# EasyEDA Pro project PCB_2025-11-01.epro

# Board FINAL
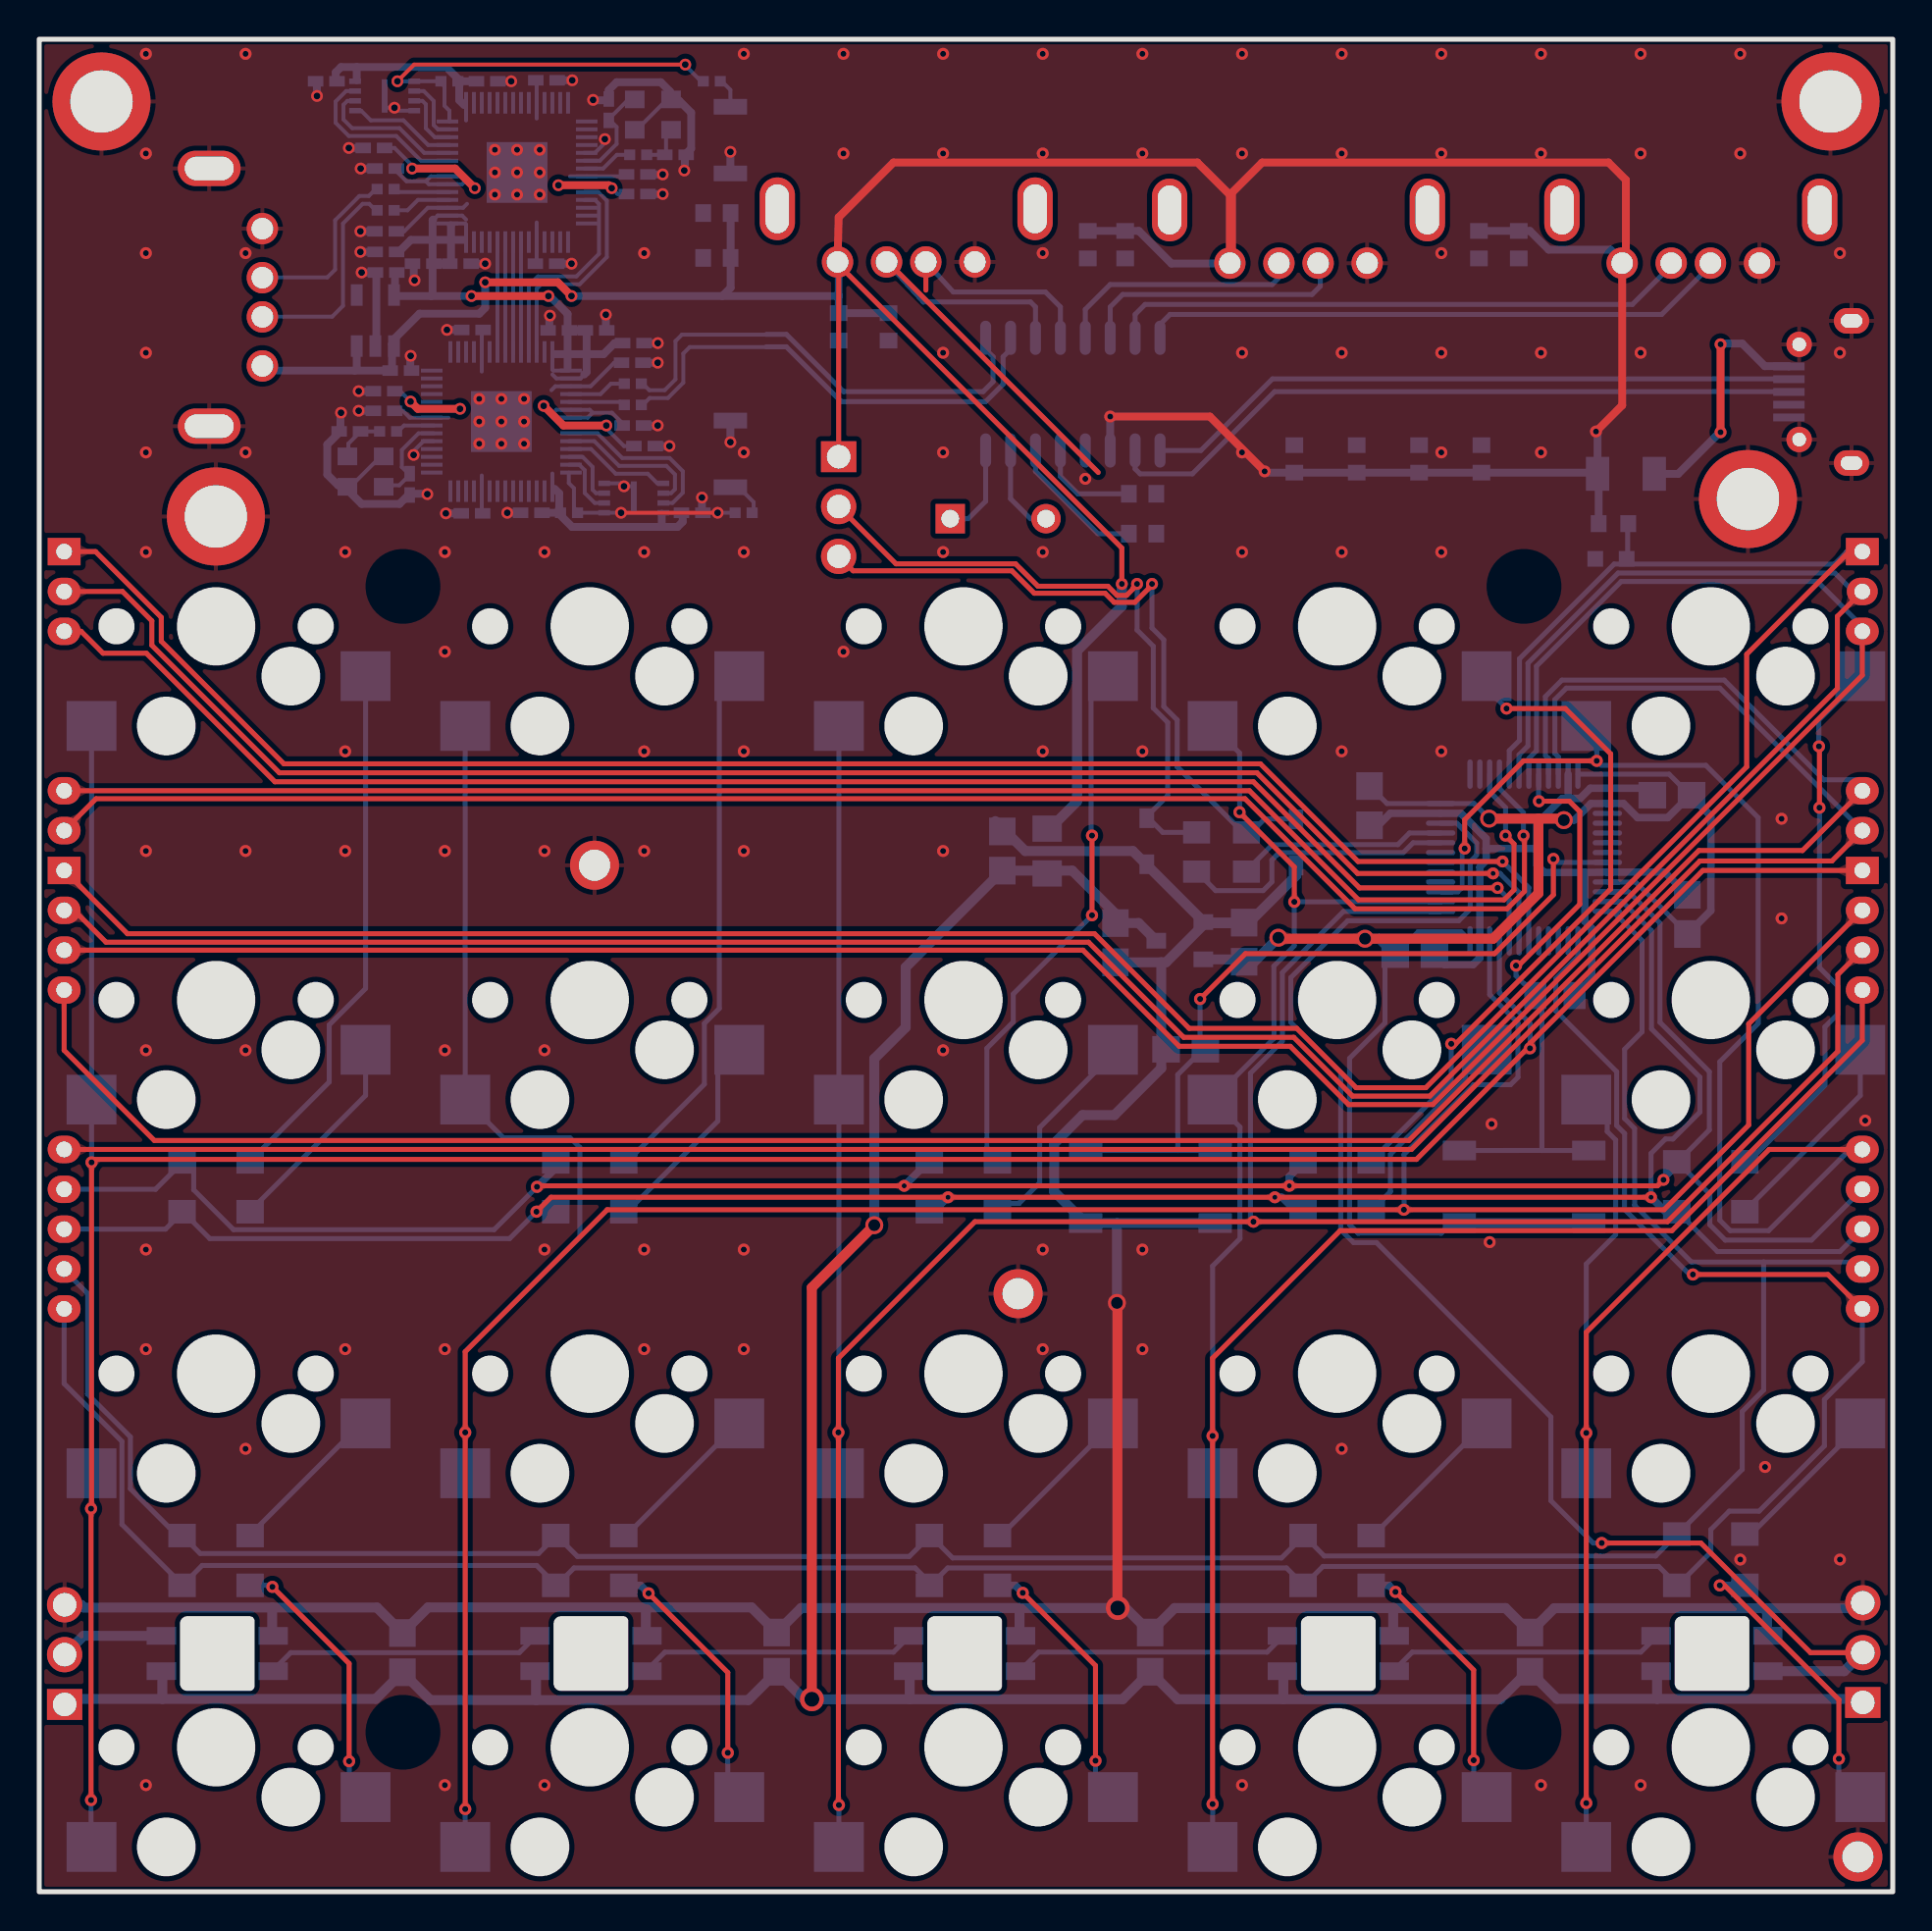
[diagram p0: board, top side]
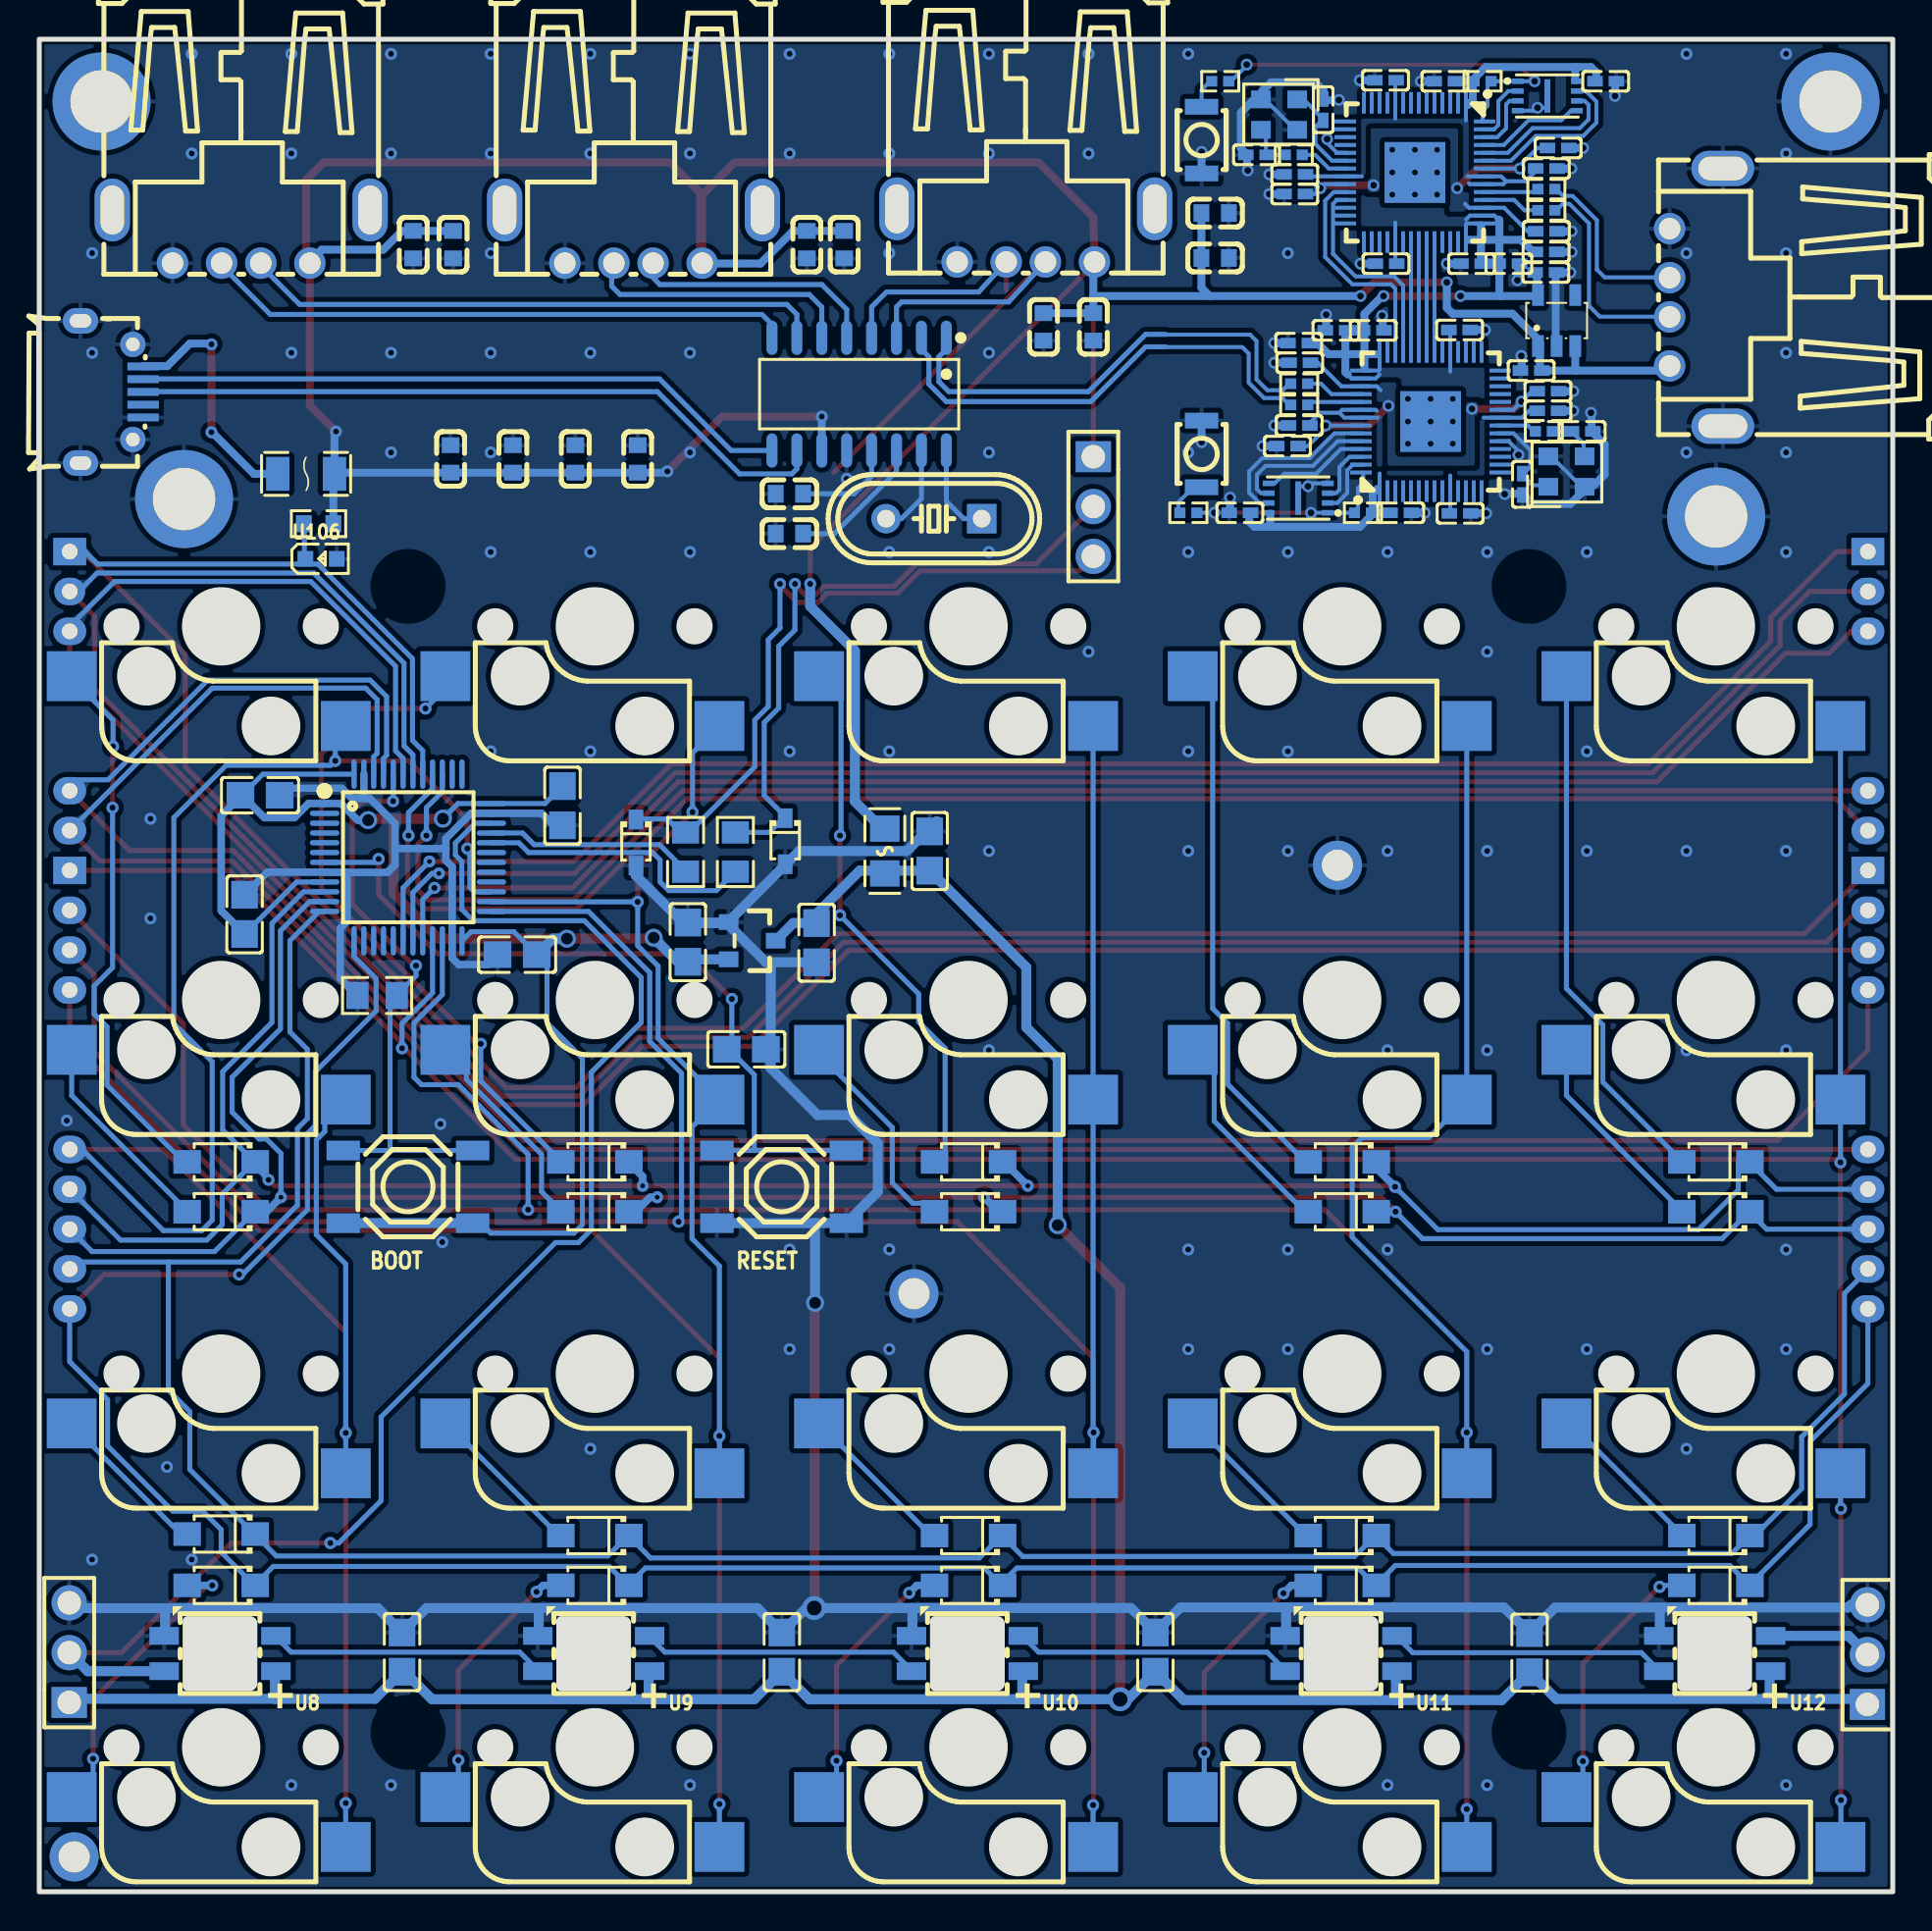
[diagram p1: board, bottom side, seen from below]

Outline 94.49 x 94.45 mm; copper layers: Top Layer, Bottom Layer. Coordinates in mm from the lower left corner of the outline.
Outline path: rectangle 0,94.45 94.49,0
Stack: Top Layer 0.035mm / Dielectric1 1.51mm FR4 er 4.5 / Bottom Layer 0.035mm

## Design rules (mm)
template: JLCPCB Capability(Two Layers Board)
spacing copperThickness1oz (default): track to track 0.102, other pairs 0.152 to 0.3
spacing copperThickness2oz: track to track 0.203, other pairs 0.152 to 0.3
track width copperThickness1oz (default): min 0.127, default 0.254, max 2.54
track width copperThickness2oz: min 0.203, default 0.254, max 2.54
differential pair differentialPair (default): width min 0.127, default 0.254, max 2.54; gap min 0.152, default 0.152
via viaSize (default): diameter min 0.5, default 0.61, max 10; hole min 0.3, default 0.305, max 6.3

## Placement (name value [footprint] x y rotation side)
C1  100nF  [C0402]  17.06 88.91 180 bottom
C2  100nF  [C0402]  30.49 86.56 0 bottom
C3  100nF  [C0402]  17.66 87.86 180 bottom
C4  100nF  [C0402]  22.84 92.31 0 bottom
C5  100nF  [C0402]  25.84 83.01 0 bottom
C6  100nF  [C0402]  25.86 92.36 0 bottom
C7  100nF  [C0402]  30.49 87.56 0 bottom
C8  100nF  [C0402]  21.47 83.01 0 bottom
C9  100nF  [C0402]  19.57 83.01 180 bottom
C10  1uF  [C0402]  17.67 83.61 180 bottom
C11  10uF  [C0603]  67.16 73.05 90 bottom
C12  100nF  [C0603]  34.55 83.3 180 bottom
C13  1uF  [C0402]  17.66 84.66 180 bottom
C14  100nF  [C0603]  63.99 73.05 90 bottom
C15  1uF  [C0402]  18.44 77.56 0 bottom
C16  1uF  [C0402]  17.69 82.56 180 bottom
C17  100nF  [C0402]  14.64 92.31 180 bottom
C18  15pF  [C0402]  29.04 90.86 270 bottom
C19  15pF  [C0402]  32.44 88.56 0 bottom
C20  10uF  [C0603]  34.55 85.58 180 bottom
C21  10uF  [C0603]  53.46 83.97 270 bottom
C22  100nF  [C0603]  55.36 83.97 270 bottom
C23  100nF  [C0603]  73.39 83.97 270 bottom
C24  10uF  [C0603]  75.43 83.97 270 bottom
C25  10uF  [C0603]  40.76 79.78 270 bottom
C26  100nF  [C0603]  43.3 79.78 270 bottom
C27  100nF  [C0603]  70.34 73.05 90 bottom
C28  10uF  [C0603]  73.52 73.05 90 bottom
C29  10uF  [C0603]  56.25 69.24 0 bottom
C30  10uF  [C0603]  56.25 71.27 0 bottom
C31  10uF  [C0805]  49.1 53.06 270 bottom
C32  100nF  [C0805]  67.82 55.37 90 bottom
C33  100nF  [C0805]  83.24 55.91 0 bottom
C34  100nF  [C0805]  54.86 48.39 90 bottom
C35  10uF  [C0805]  61.43 48.41 270 bottom
C36  100nF  [C0805]  70.13 47.78 180 bottom
C37  100nF  [C0805]  84.02 49.83 270 bottom
C38  100nF  [C0805]  58.45 42.95 0 bottom
C39  100nF  [C0805]  18.52 12.19 270 bottom
C40  100nF  [C0805]  37.59 12.22 270 bottom
C41  100nF  [C0805]  56.63 12.22 270 bottom
C42  100nF  [C0805]  76 12.22 270 bottom
C101  100nF  [C0402]  30.86 73.71 0 bottom
C102  100nF  [C0402]  17.58 76.51 180 bottom
C103  100nF  [C0402]  30.26 74.76 0 bottom
C104  100nF  [C0402]  25.09 70.31 180 bottom
C105  100nF  [C0402]  22.09 79.63 180 bottom
C106  100nF  [C0402]  22.06 70.28 180 bottom
C107  100nF  [C0402]  17.58 75.51 180 bottom
C108  100nF  [C0402]  26.49 79.61 180 bottom
C109  100nF  [C0402]  28.39 79.61 0 bottom
C110  1uF  [C0402]  30.29 78.96 0 bottom
C113  1uF  [C0402]  30.23 77.96 0 bottom
C117  100nF  [C0402]  33.29 70.31 0 bottom
C118  15pF  [C0402]  18.89 71.76 90 bottom
C119  15pF  [C0402]  15.84 74.46 180 bottom
D1  MM3Z3V6T1G  [SOD-323_L1.8-W1.3-LS2.5-RD]  64.07 53.49 270 bottom
D2  MM3Z3V6T1G  [SOD-323_L1.8-W1.3-LS2.5-RD]  56.46 53.56 270 bottom
D3  DSK110  [SOD-123FL_L2.7-W1.8-LS3.8-RD]  9.02 37.21 0 bottom
D4  DSK110  [SOD-123FL_L2.7-W1.8-LS3.8-RD]  28.07 37.21 0 bottom
D5  DSK110  [SOD-123FL_L2.7-W1.8-LS3.8-RD]  47.12 37.21 0 bottom
D6  DSK110  [SOD-123FL_L2.7-W1.8-LS3.8-RD]  66.17 37.21 0 bottom
D7  DSK110  [SOD-123FL_L2.7-W1.8-LS3.8-RD]  85.22 37.21 0 bottom
D8  DSK110  [SOD-123FL_L2.7-W1.8-LS3.8-RD]  9.02 34.67 0 bottom
D9  DSK110  [SOD-123FL_L2.7-W1.8-LS3.8-RD]  28.07 34.67 0 bottom
D10  DSK110  [SOD-123FL_L2.7-W1.8-LS3.8-RD]  47.12 34.67 0 bottom
D11  DSK110  [SOD-123FL_L2.7-W1.8-LS3.8-RD]  66.17 34.67 0 bottom
D12  DSK110  [SOD-123FL_L2.7-W1.8-LS3.8-RD]  85.22 34.67 0 bottom
D13  DSK110  [SOD-123FL_L2.7-W1.8-LS3.8-RD]  9.02 18.16 0 bottom
D14  DSK110  [SOD-123FL_L2.7-W1.8-LS3.8-RD]  28.07 18.16 0 bottom
D15  DSK110  [SOD-123FL_L2.7-W1.8-LS3.8-RD]  47.12 18.16 0 bottom
D16  DSK110  [SOD-123FL_L2.7-W1.8-LS3.8-RD]  66.17 18.16 0 bottom
D17  DSK110  [SOD-123FL_L2.7-W1.8-LS3.8-RD]  85.22 18.24 0 bottom
D18  DSK110  [SOD-123FL_L2.7-W1.8-LS3.8-RD]  9.02 15.62 0 bottom
D19  DSK110  [SOD-123FL_L2.7-W1.8-LS3.8-RD]  28.07 15.62 0 bottom
D20  DSK110  [SOD-123FL_L2.7-W1.8-LS3.8-RD]  47.12 15.62 0 bottom
D21  DSK110  [SOD-123FL_L2.7-W1.8-LS3.8-RD]  66.17 15.62 0 bottom
D22  DSK110  [SOD-123FL_L2.7-W1.8-LS3.8-RD]  85.22 15.62 0 bottom
F1  FSMD100-1206R  [F1206]  80.89 72.29 0 bottom
FUSE1  BSMD0805-110-6V  [F0805]  51.38 53.06 270 bottom
H1  77311-102-03LF  [HDR-TH_3P-P2.54-V-M-1]  40.76 70.62 270 bottom
J1  77311-102-03LF  [HDR-TH_3P-P2.54-V-M-1]  1.3 12.09 90 bottom
J2  77311-102-03LF  [HDR-TH_3P-P2.54-V-M-1]  92.96 12.19 90 bottom
KEY1  TS-1187A-C-B-B  [SW-SMD_4P-L5.1-W5.1-P3.70-LS6.5-TL_H1.6]  75.69 35.94 0 bottom
KEY2  TS-1187A-C-B-B  [SW-SMD_4P-L5.1-W5.1-P3.70-LS6.5-TL_H1.6]  56.64 35.94 0 bottom
NOREF  -  [Pad_e2917]  92.94 66.29 0 top
NOREF#2  -  [Pad_e2929]  1.27 66.29 0 top
NOREF#3  -  [Pad_e2928]  1.27 68.33 0 top
NOREF#4  -  [Pad_e2934]  1.27 54.1 0 top
NOREF#5  -  [Pad_e2931]  1.27 56.13 0 top
NOREF#6  -  [Pad_e6663]  9.01 70.12 270 top
NOREF#7  -  [Pad_e2927]  92.94 35.81 0 top
NOREF#8  -  [Pad_e6665]  91.32 91.27 270 top
NOREF#9  -  [Pad_e2919]  92.94 52.07 0 top
NOREF#10  -  [Pad_e2924]  92.94 29.72 0 top
NOREF#11  -  [Pad_e2942]  92.94 48.01 0 top
NOREF#12  -  [Pad_e2923]  92.94 50.04 0 top
NOREF#13  -  [Pad_e2933]  1.27 37.85 0 top
NOREF#14  -  [Pad_e2920]  92.94 54.1 0 top
NOREF#15  -  [Pad_e2939]  1.27 33.78 0 top
NOREF#16  -  [Pad_e2940]  1.27 31.75 0 top
NOREF#17  -  [Pad_e2921]  92.94 56.13 0 top
NOREF#18  -  [Pad_e2941]  1.27 29.72 0 top
NOREF#19  -  [Pad_e2935]  1.27 52.07 0 top
NOREF#20  -  [Pad_e6672]  49.9 30.49 180 top
NOREF#21  -  [Pad_e2932]  1.27 45.97 0 top
NOREF#22  -  [Pad_e2943]  92.94 45.97 0 top
NOREF#23  -  [Pad_e2916]  92.94 64.26 0 top
NOREF#24  -  [Pad_e2938]  1.27 35.81 0 top
NOREF#25  -  [Pad_e6670]  92.71 1.78 180 top
NOREF#26  -  [Pad_e2937]  1.27 48.01 0 top
NOREF#27  -  [Pad_e2918]  92.94 68.33 0 top
NOREF#28  -  [Pad_e2930]  1.27 64.26 0 top
NOREF#29  -  [Pad_e2922]  92.94 37.85 0 top
NOREF#30  -  [Pad_e6671]  28.31 52.34 180 top
NOREF#31  -  [Pad_e6662]  3.17 91.27 0 top
NOREF#32  -  [Pad_e2936]  1.27 50.04 0 top
NOREF#33  -  [Pad_e2926]  92.94 33.78 0 top
NOREF#34  -  [Pad_e6664]  87.11 71 0 top
NOREF#35  -  [Pad_e2925]  92.94 31.75 0 top
R1  2kΩ  [R0603]  80.25 69.75 0 bottom
R2  10kΩ  [R0805]  77.27 45.69 180 bottom
R3  27Ω  [R0402]  17.66 86.81 0 bottom
R4  27Ω  [R0402]  17.66 85.73 0 bottom
R5  10kΩ  [R0402]  20.91 92.31 180 bottom
R6  1kΩ  [R0402]  34.29 92.31 0 bottom
R7  1kΩ  [R0402]  30.54 88.56 180 bottom
R8  22Ω  [R0805]  59 53.01 270 bottom
R9  22Ω  [R0805]  61.54 53.01 270 bottom
R103  27Ω  [R0402]  30.26 75.81 180 bottom
R104  27Ω  [R0402]  30.26 76.89 180 bottom
R105  10kΩ  [R0402]  27.01 70.31 0 bottom
R106  1kΩ  [R0402]  35.91 70.31 0 bottom
R107  1kΩ  [R0402]  17.79 74.46 0 bottom
SW1  KB01  [HSWAP_SCK]  9.02 64.52 180 bottom
SW2  B3U-1000P  [KEY-SMD_B3U-1000PM]  35.24 89.31 90 bottom
SW3  KB01  [HSWAP_SCK]  47.12 64.52 180 bottom
SW4  KB01  [HSWAP_SCK]  66.17 64.52 180 bottom
SW5  KB01  [HSWAP_SCK]  85.22 64.52 180 bottom
SW6  KB01  [HSWAP_SCK]  9.02 45.47 180 bottom
SW7  KB01  [HSWAP_SCK]  28.07 45.47 180 bottom
SW8  KB01  [HSWAP_SCK]  47.12 45.47 180 bottom
SW9  KB01  [HSWAP_SCK]  66.17 45.47 180 bottom
SW10  KB01  [HSWAP_SCK]  85.22 45.47 180 bottom
SW11  KB01  [HSWAP_SCK]  9.02 26.42 180 bottom
SW12  KB01  [HSWAP_SCK]  28.07 26.42 180 bottom
SW13  KB01  [HSWAP_SCK]  47.12 26.42 180 bottom
SW14  KB01  [HSWAP_SCK]  66.17 26.42 180 bottom
SW15  KB01  [HSWAP_SCK]  85.22 26.42 180 bottom
SW16  KB01  [HSWAP_SCK]  9.02 7.37 180 bottom
SW17  KB01  [HSWAP_SCK]  28.07 7.37 180 bottom
SW18  KB01  [HSWAP_SCK]  47.12 7.37 180 bottom
SW19  KB01  [HSWAP_SCK]  66.17 7.37 180 bottom
SW20  KB01  [HSWAP_SCK]  85.22 7.37 180 bottom
SW21  KB01  [HSWAP_SCK]  28.07 64.52 180 bottom
SW102  B3U-1000P  [KEY-SMD_B3U-1000PM]  35.24 73.31 270 bottom
U1  SL2.1A  [SOP-16_L10.0-W3.9-P1.27-LS6.0-BL]  52.69 76.35 0 bottom
U2  XC6206-3.3V  [SSOT-3_L2.9-W1.6-P0.95-LS2.8-BR]  58.15 48.49 0 bottom
U3  RP2040  [LQFN-56_L7.0-W7.0-P0.4-EP]  24.36 87.66 270 bottom
U4  TLV73333PDBVR  [SOT-23-5_L3.0-W1.7-P0.95-LS2.8-BR]  17.14 80.11 270 bottom
U5  W25Q16JVUXIQ  [USON-8_L3.0-W2.0-P0.50-BL-EP]  17.61 91.56 270 bottom
U6  STM32F072CBT6  [LQFP-48_L7.0-W7.0-P0.50-LS9.0-BL]  75.69 52.73 270 bottom
U8  WS2812B-MINI-V3J  [LED-SMD_4P-L3.5-W3.5-P1.80-LS6.2_WS2812B-MINI-V3J]  85.28 12.15 0 bottom
U9  WS2812B-MINI-V3J  [LED-SMD_4P-L3.5-W3.5-P1.80-LS6.2_WS2812B-MINI-V3J]  66.23 12.15 0 bottom
U10  WS2812B-MINI-V3J  [LED-SMD_4P-L3.5-W3.5-P1.80-LS6.2_WS2812B-MINI-V3J]  47.18 12.15 0 bottom
U11  WS2812B-MINI-V3J  [LED-SMD_4P-L3.5-W3.5-P1.80-LS6.2_WS2812B-MINI-V3J]  28.13 12.15 0 bottom
U12  WS2812B-MINI-V3J  [LED-SMD_4P-L3.5-W3.5-P1.80-LS6.2_WS2812B-MINI-V3J]  9.08 12.15 0 bottom
U103  RP2040  [LQFN-56_L7.0-W7.0-P0.4-EP]  23.56 74.96 90 bottom
U105  W25Q16JVUXIQ  [USON-8_L3.0-W2.0-P0.50-BL-EP]  30.31 71.06 90 bottom
U106  IN-S63AT5UW  [LED0603-RD]  80.13 67.96 180 bottom
USB1  U-USBAR04P-F002  [USB-A-TH_USB-302-T]  10.02 81.29 90 bottom
USB2  U-USBAR04P-F002  [USB-A-TH_USB-302-T]  84.2 84.39 0 bottom
USB3  U-USBAR04P-F002  [USB-A-TH_USB-302-T]  64.2 84.39 0 bottom
USB4  U-USBAR04P-F002  [USB-A-TH_USB-302-T]  44.2 84.45 0 bottom
USB5  MicroXNJ  [MICRO-USB-SMD_MICROXNJ]  90.79 76.47 270 bottom
X1  12MHz  [HC-49US_L11.5-W4.5-P4.88]  48.88 70 0 bottom
Y1  12MHz  [CRYSTAL-SMD_4P-L2.5-W2.0-BL-A]  31.29 90.61 0 bottom
Y101  12MHz  [CRYSTAL-SMD_4P-L2.5-W2.0-BL-A]  16.64 72.41 180 bottom

## Footprints (pads in the part's own frame, mm; a bottom-side part is the same pattern mirrored in y, then rotated)
C0402
  rect 0.79x0.54 smd: 1(-0.545,0) 2(0.545,0)
C0603
  rect 0.8x0.9 smd: 1(-0.7,0) 2(0.7,0)
C0805
  rect 1.41x1.35 smd: 1(-1,0) 2(1,0)
CRYSTAL-SMD_4P-L2.5-W2.0-BL-A
  rect 1x0.9 smd: 1(-0.925,-0.775) 2(0.925,-0.775) 3(0.925,0.775) 4(-0.925,0.775)
F0805
  rect 1.335x1.5 smd: 1(-1.143,0) 2(1.143,0)
F1206
  rect 1.19x1.728 smd: 1(-1.445,0) 2(1.445,0)
HC-49US_L11.5-W4.5-P4.88
  rect 1.5x1.5 hole 0.9: 1(-2.44,0)
  round 1.5 hole 0.9: 2(2.44,0)
HDR-TH_3P-P2.54-V-M-1
  rect 1.575x1.8 hole 1.2: 1(-2.54,0)
  round 1.8 hole 1.2: 2(0,0) 3(2.54,0)
HSWAP_SCK
  rect 2.54x2.54 smd: 1(-7.62,-2.54) 2(6.35,-5.08)
KEY-SMD_B3U-1000PM
  rect 0.8x1.7 smd: 1(-1.7,0) 2(1.7,0)
LED0603-RD
  rect 0.8x0.8 smd: 1(-0.799,0) 2(0.799,0)
LED-SMD_4P-L3.5-W3.5-P1.80-LS6.2_WS2812B-MINI-V3J
  rect 1.5x0.9 smd: 1(-2.85,0.9) 2(-2.85,-0.9) 3(2.85,-0.9) 4(2.85,0.9)
LQFN-56_L7.0-W7.0-P0.4-EP
  rect 1.1x0.2 smd: 1(-3.55,2.6) 2(-3.55,2.2) 3(-3.55,1.8) 4(-3.55,1.4) 5(-3.55,1) 6(-3.55,0.6) 7(-3.55,0.2) 8(-3.55,-0.2) 9(-3.55,-0.6) 10(-3.55,-1) 11(-3.55,-1.4) 12(-3.55,-1.8) 13(-3.55,-2.2) 14(-3.55,-2.6) 29(3.55,-2.6) 30(3.55,-2.2) 31(3.55,-1.8) 32(3.55,-1.4) 33(3.55,-1) 34(3.55,-0.6) 35(3.55,-0.2) 36(3.55,0.2) 37(3.55,0.6) 38(3.55,1) 39(3.55,1.4) 40(3.55,1.8) 41(3.55,2.2) 42(3.55,2.6)
  rect 0.2x1.1 smd: 15(-2.6,-3.55) 16(-2.2,-3.55) 17(-1.8,-3.55) 18(-1.4,-3.55) 19(-1,-3.55) 20(-0.6,-3.55) 21(-0.2,-3.55) 22(0.2,-3.55) 23(0.6,-3.55) 24(1,-3.55) 25(1.4,-3.55) 26(1.8,-3.55) 27(2.2,-3.55) 28(2.6,-3.55) 43(2.6,3.55) 44(2.2,3.55) 45(1.8,3.55) 46(1.4,3.55) 47(1,3.55) 48(0.6,3.55) 49(0.2,3.55) 50(-0.2,3.55) 51(-0.6,3.55) 52(-1,3.55) 53(-1.4,3.55) 54(-1.8,3.55) 55(-2.2,3.55) 56(-2.6,3.55)
  rect 3.1x3.1 smd: 57(0,0)
LQFP-48_L7.0-W7.0-P0.50-LS9.0-BL
  oval 0.27x1.5 smd: 1(-2.75,-4.25) 2(-2.25,-4.25) 3(-1.75,-4.25) 4(-1.25,-4.25) 5(-0.75,-4.25) 6(-0.25,-4.25) 7(0.25,-4.25) 8(0.75,-4.25) 9(1.25,-4.25) 10(1.75,-4.25) 11(2.25,-4.25) 12(2.75,-4.25) 25(2.75,4.25) 26(2.25,4.25) 27(1.75,4.25) 28(1.25,4.25) 29(0.75,4.25) 30(0.25,4.25) 31(-0.25,4.25) 32(-0.75,4.25) 33(-1.25,4.25) 34(-1.75,4.25) 35(-2.25,4.25) 36(-2.75,4.25)
  oval 1.5x0.27 smd: 13(4.25,-2.75) 14(4.25,-2.25) 15(4.25,-1.75) 16(4.25,-1.25) 17(4.25,-0.75) 18(4.25,-0.25) 19(4.25,0.25) 20(4.25,0.75) 21(4.25,1.25) 22(4.25,1.75) 23(4.25,2.25) 24(4.25,2.75) 37(-4.25,2.75) 38(-4.25,2.25) 39(-4.25,1.75) 40(-4.25,1.25) 41(-4.25,0.75) 42(-4.25,0.25) 43(-4.25,-0.25) 44(-4.25,-0.75) 45(-4.25,-1.25) 46(-4.25,-1.75) 47(-4.25,-2.25) 48(-4.25,-2.75)
MICRO-USB-SMD_MICROXNJ
  rect 0.4x1.6 smd: 1(-1.3,1.597) 2(-0.65,1.597) 3(0,1.597) 4(0.65,1.597) 5(1.3,1.597)
  round 1.3 hole 0.7: 6(2.425,1.074) 9(-2.425,1.073)
  oval 1.3x1.8 hole 0.7x1.1: 7(3.625,-1.597) 8(-3.625,-1.597)
Pad_e2916
  oval 1.677x1.397 hole 0.8: 4(0,0)
Pad_e2917
  oval 1.575x1.397 hole 0.8: 3(0,0)
Pad_e2918
  rect 1.677x1.397 hole 0.8: 2(0,0)
Pad_e2919
  rect 1.677x1.397 hole 0.8: 3(0,0)
Pad_e2920
  oval 1.677x1.397 hole 0.8: 2(0,0)
Pad_e2921
  oval 1.677x1.397 hole 0.8: 1(0,0)
Pad_e2922
  oval 1.677x1.397 hole 0.8: 2(0,0)
Pad_e2923
  oval 1.677x1.397 hole 0.8: 1(0,0)
Pad_e2924
  oval 1.677x1.397 hole 0.8: 4(0,0)
Pad_e2925
  oval 1.677x1.397 hole 0.8: 3(0,0)
Pad_e2926
  oval 1.677x1.397 hole 0.8: 2(0,0)
Pad_e2927
  oval 1.677x1.397 hole 0.8: 1(0,0)
Pad_e2928
  rect 1.677x1.397 hole 0.8: 1(0,0)
Pad_e2929
  oval 1.677x1.397 hole 0.8: 2(0,0)
Pad_e2930
  oval 1.677x1.397 hole 0.8: 3(0,0)
Pad_e2931
  oval 1.677x1.397 hole 0.8: 4(0,0)
Pad_e2932
  oval 1.677x1.397 hole 0.8: 1(0,0)
Pad_e2933
  oval 1.677x1.397 hole 0.8: 2(0,0)
Pad_e2934
  oval 1.677x1.397 hole 0.8: 1(0,0)
Pad_e2935
  rect 1.677x1.397 hole 0.8: 2(0,0)
Pad_e2936
  oval 1.677x1.397 hole 0.8: 3(0,0)
Pad_e2937
  oval 1.677x1.397 hole 0.8: 4(0,0)
Pad_e2938
  oval 1.677x1.397 hole 0.8: 1(0,0)
Pad_e2939
  oval 1.677x1.397 hole 0.8: 2(0,0)
Pad_e2940
  oval 1.677x1.397 hole 0.8: 3(0,0)
Pad_e2941
  oval 1.677x1.397 hole 0.8: 4(0,0)
Pad_e2942
  oval 1.677x1.397 hole 0.8: 2(0,0)
Pad_e2943
  oval 1.677x1.397 hole 0.8: 3(0,0)
Pad_e6662
  round 5 hole 3.18x3.175: 0(0,0)
Pad_e6663
  round 5 hole 3.18x3.175: 0(0,0)
Pad_e6664
  round 5 hole 3.18x3.175: 0(0,0)
Pad_e6665
  round 5 hole 3.18x3.175: 0(0,0)
Pad_e6670
  round 2.5 hole 1.587: 0(0,0)
Pad_e6671
  round 2.5 hole 1.587: 0(0,0)
Pad_e6672
  round 2.5 hole 1.587: 0(0,0)
R0402
  rect 0.566x0.54 smd: 1(-0.433,0) 2(0.433,0)
R0603
  rect 0.806x0.864 smd: 1(-0.753,0) 2(0.753,0)
R0805
  rect 1.133x1.377 smd: 1(-1,0) 2(1,0)
SOD-123FL_L2.7-W1.8-LS3.8-RD
  rect 1.4x1.2 smd: 1(-1.735,0) 2(1.735,0)
SOD-323_L1.8-W1.3-LS2.5-RD
  rect 1x0.75 smd: 1(-1.173,0) 2(1.173,0)
SOP-16_L10.0-W3.9-P1.27-LS6.0-BL
  oval 0.56x1.745 smd: 1(-4.445,-2.873) 2(-3.175,-2.873) 3(-1.905,-2.873) 4(-0.635,-2.873) 5(0.635,-2.873) 6(1.905,-2.873) 7(3.175,-2.873) 8(4.445,-2.873) 9(4.445,2.873) 10(3.175,2.873) 11(1.905,2.873) 12(0.635,2.873) 13(-0.635,2.873) 14(-1.905,2.873) 15(-3.175,2.873) 16(-4.445,2.873)
SOT-23-5_L3.0-W1.7-P0.95-LS2.8-BR
  rect 1.1x0.6 smd: 1(1.3,-0.95) 2(1.3,0) 3(1.3,0.95) 4(-1.3,0.95) 5(-1.3,-0.95)
SSOT-3_L2.9-W1.6-P0.95-LS2.8-BR
  rect 1x0.8 smd: 1(1.2,-0.95) 2(1.2,0.95) 3(-1.2,0)
SW-SMD_4P-L5.1-W5.1-P3.70-LS6.5-TL_H1.6
  rect 1.7x1 smd: 1(-3.3,1.85) 2(3.3,1.85) 3(-3.3,-1.85) 4(3.3,-1.85)
USB-A-TH_USB-302-T
  round 1.6 hole 1.1: 1(-3.5,1.355) 2(-1,1.355) 3(1,1.355) 4(3.5,1.355)
  oval 1.8x3.2 hole 1.2x2.5: 5(-6.57,-1.355) 6(6.57,-1.355)
USON-8_L3.0-W2.0-P0.50-BL-EP
  rect 0.28x0.6 smd: 1(-0.75,-1.508) 2(-0.25,-1.508) 3(0.25,-1.508) 4(0.75,-1.508) 5(0.75,1.508) 6(0.25,1.508) 7(-0.25,1.508) 8(-0.75,1.508)
  rect 1.7x0.3 smd: 9(0,0)

## Nets
+1V1: C1.1 C2.1 C13.1 U3.23 U3.45 U3.50
+1V2: C101.1 C102.1 C113.1 U103.23 U103.45 U103.50
+3.3V: C32.2 C33.2 C35.2 C36.2 C37.2 KEY1.1 KEY1.2 U2.2 U6.1 U6.9 U6.24 U6.36 U6.48
+3V3: C3.1 C4.1 C5.1 C6.1 C7.1 C8.1 C9.1 C10.1 C16.1 C17.1 C103.1 C104.1 C105.1 C106.1 C107.1 C108.1 C109.1 C110.1 C117.1 R5.1 R105.1 U3.1 U3.10 U3.22 U3.33 U3.42 U3.43 U3.44 U3.48 U3.49 U4.5 U5.8 U103.1 U103.10 U103.22 U103.33 U103.42 U103.43 U103.44 U103.48 U103.49 U105.8
+5V: C11.1 C12.1 C14.1 C15.1 C20.1 C21.1 C22.1 C23.1 C24.1 C25.1 C26.1 C27.1 C28.1 F1.1 H1.1 R1.1 U1.11 U4.1 U4.3 USB1.1 USB2.1 USB3.1 USB4.1
GND: C1.2 C2.2 C3.2 C4.2 C5.2 C6.2 C7.2 C8.2 C9.2 C10.2 C11.2 C12.2 C13.2 C14.2 C15.2 C16.2 C17.2 C18.1 C19.2 C20.2 C21.2 C22.2 C23.2 C24.2 C25.2 C26.2 C27.2 C28.2 C29.2 C30.2 C31.1 C32.1 C33.1 C34.1 C35.1 C36.1 C37.1 C38.1 C39.1 C40.1 C41.1 C42.1 C101.2 C102.2 C103.2 C104.2 C105.2 C106.2 C107.2 C108.2 C109.2 C110.2 C113.2 C117.2 C118.1 C119.2 D1.2 D2.2 J1.3 J2.3 KEY2.1 KEY2.2 NOREF#6.0 NOREF#8.0 NOREF#20.0 NOREF#25.0 NOREF#30.0 NOREF#31.0 NOREF#34.0 R2.1 SW2.1 SW102.1 U1.12 U2.1 U3.19 U3.57 U4.2 U5.4 U6.8 U6.23 U6.35 U6.47 U8.3 U9.3 U10.3 U11.3 U12.3 U103.19 U103.57 U105.4 U106.2 USB1.4 USB1.5 USB1.6 USB2.4 USB3.4 USB4.4 USB5.5 USB5.6 USB5.7 USB5.8 USB5.9 Y1.2 Y1.4 Y101.2 Y101.4
VBUS: F1.2 USB5.1
VCC: C31.2 C34.2 C39.2 C40.2 C41.2 C42.2 FUSE1.2 J1.1 J2.1 U2.3 U8.1 U9.1 U10.1 U11.1 U12.1
VDD18: C29.1 U1.14
VDD33: C30.1 U1.13
1D+: R103.1
1D-: R104.1
1GPIO0: U103.2
1GPIO1: U103.3
1GPIO4: U103.6
1GPIO5: U103.7
1QSPI_SCLK: U103.52 U105.6
1QSPI_SD0: U103.53 U105.5
1QSPI_SD1: U103.55 U105.2
1QSPI_SD2: U103.54 U105.3
1QSPI_SD3: U103.51 U105.7
1QSPI_SS: R105.2 R106.1 U103.56 U105.1
1XIN: C118.2 U103.20 Y101.1
1XOUT: R107.2 U103.21
$C1_2: C38.2 KEY2.3 KEY2.4 U6.7
$C19_1: C19.1 R7.1 Y1.3
$C119_1: C119.1 R107.1 Y101.3
$D1_1: D1.1 H1.3 R9.1
$D2_1: D2.1 H1.2 R8.1
$D3_2: D3.2 SW1.1
$D4_2: D4.2 SW21.1
$D5_2: D5.2 SW3.1
$D6_2: D6.2 SW4.1
$D7_2: D7.2 SW5.1
$D8_2: D8.2 SW6.1
$D9_2: D9.2 SW7.1
$D10_2: D10.2 SW8.1
$D11_2: D11.2 SW9.1
$D12_2: D12.2 SW10.1
$D13_2: D13.2 SW11.1
$D14_2: D14.2 SW12.1
$D15_2: D15.2 SW13.1
$D16_2: D16.2 SW14.1
$D17_2: D17.2 SW15.1
$D18_2: D18.2 SW16.1
$D19_2: D19.2 SW17.1
$D20_2: D20.2 SW18.1
$D21_2: D21.2 SW19.1
$D22_2: D22.2 SW20.1
$FUSE1_1: FUSE1.1
$J1_2: J1.2 U12.2
$KEY1_3: KEY1.3 KEY1.4 R2.2 U6.44
$LED1_1: R1.2
$R3_2: R3.2 U3.47
$R4_2: R4.2 U3.46
$R6_2: R6.2 SW2.2
$R103_2: R103.2 U103.47
$R104_2: R104.2 U103.46
$R106_2: R106.2 SW102.2
$U1_2: U6.2
$U1_3: U6.3
$U1_4: U6.4
$U1_5: U6.5
$U1_6: U6.6
$U1_15: U6.15
$U1_16: U6.16
$U1_17: U6.17
$U1_28: U6.28
$U1_29: U6.29
$U1_30: U6.30
$U1_31: U6.31
$U1_37: U6.37
$U1_38: U6.38
$U8_2: U8.2 U9.4
$U10_2: U10.2 U11.4
$U10_4: U9.2 U10.4
$U11_2: U11.2 U12.4
COL1: NOREF#3.1 U6.18
COL2: NOREF#2.2 U6.19
COL3: NOREF#28.3 U6.20
COL4: NOREF#5.4 U6.39
COL5: NOREF#4.1 U6.40
COL6: NOREF#19.2 NOREF#27.2 U6.41 U106.1
COL7: NOREF.3 NOREF#32.3 U6.42
COL8: NOREF#23.4 NOREF#26.4 U6.43
COL9: NOREF#17.1 NOREF#21.1 U6.45
COL10: NOREF#13.2 NOREF#14.2 U6.46
COL11: NOREF#9.3 SW1.2 SW6.2 SW11.2 SW16.2 U6.21
COL12: NOREF#12.1 SW7.2 SW12.2 SW17.2 SW21.2 U6.22
COL13: NOREF#11.2 SW3.2 SW8.2 SW13.2 SW18.2 U6.25
COL14: NOREF#22.3 SW4.2 SW9.2 SW14.2 SW19.2 U6.26
COL15: NOREF#29.2 SW5.2 SW10.2 SW15.2 SW20.2 U6.27
CTS1RTS: U3.38 U103.35
D+: R3.1 R9.2 U6.33 USB1.3
D-: R4.1 R8.2 U6.32 USB1.2
DM: U1.9 USB5.2
DM1: U1.7 USB2.2
DM2: U1.5 USB3.2
DM3: U1.3 USB4.2
DM4: U1.1
DP: U1.10 USB5.3
DP1: U1.8 USB2.3
DP2: U1.6 USB3.3
DP3: U1.4 USB4.3
DP4: U1.2
GPIO0: U3.2
GPIO1: U3.3
GPIO4: U3.6
GPIO5: U3.7
NRGB: J2.2 U6.34 U8.4
QSPI_SCLK: U3.52 U5.6
QSPI_SD0: U3.53 U5.5
QSPI_SD1: U3.55 U5.2
QSPI_SD2: U3.54 U5.3
QSPI_SD3: U3.51 U5.7
QSPI_SS: R5.2 R6.1 U3.56 U5.1
ROW1: D3.1 D4.1 D5.1 D6.1 D7.1 NOREF#7.1 NOREF#24.1 U6.10
ROW2: D8.1 D9.1 D10.1 D11.1 D12.1 NOREF#15.2 NOREF#33.2 U6.11
ROW3: D13.1 D14.1 D15.1 D16.1 D17.1 NOREF#16.3 NOREF#35.3 U6.12
ROW4: D18.1 D19.1 D20.1 D21.1 D22.1 NOREF#10.4 NOREF#18.4 U6.13
ROW5: U6.14
RTS1CTS: U3.35 U103.38
RX1TX: U3.37 U103.36
SWCLK: U3.24 U103.40
SWD: U3.25 U103.39
TX1RX: U3.36 U103.37
XIN: C18.2 U1.16 U3.20 X1.1 Y1.1
XOUT: R7.2 U1.15 U3.21 X1.2

Pads without a net: U3 4 5 8 9 11 12 13 14 15 16 17 18 26 27 28 29 30 31 32 34 39 40 41; U4 4; U5 9; U103 4 5 8 9 11 12 13 14 15 16 17 18 24 25 26 27 28 29 30 31 32 34 41; U105 9; USB2 5 6; USB3 5 6; USB4 5 6; USB5 4

## Via types
v1: diameter 0.62, hole 0.31, Top Layer to Bottom Layer, 45 vias
v2: diameter 0.61, hole 0.254, Top Layer to Bottom Layer, 7 vias
v3: diameter 0.61, hole 0.305, Top Layer to Bottom Layer, 135 vias
v4: diameter 0.914, hole 0.61, Top Layer to Bottom Layer, 6 vias
v5: diameter 1.22, hole 0.762, Top Layer to Bottom Layer, 2 vias
v6: diameter 0.6, hole 0.35, Top Layer to Bottom Layer, 52 vias

## Routing (per net, layer and track width the routed paths; a pad name or vN(x,y) marks a point on that pad's centre or on a via; arc(x,y) is an arc through that point)
+1V1: length 17
  Top Layer w0.4: v6(22.21,86.86) 21.21,87.86 v6(19.01,87.86) ; v6(29.19,86.86) 29.04,87.01 v6(26.47,87.01)
  Bottom Layer w0.2: 30.01,86.56 29.49,86.56 v6(29.19,86.86) 28.99,87.06 27.8,87.06 ; 18.14,84.66 18.61,84.66 19.81,85.86 U3.45 21.61,85.86 21.81,86.06 ; 17.54,88.91 18.11,88.91 19.01,88.01 v6(19.01,87.86) 20.92,87.86
+1V2: length 16.9
  Top Layer w0.4: v6(18.93,75.98) 19.3,75.61 v6(21.45,75.61) ; 28.92,74.76 26.72,74.76 25.72,75.76
  Bottom Layer w0.2: 29.75,77.96 29.31,77.96 28.11,76.76 U103.45 26.31,76.76 26.11,76.56 ; 27,74.76 v6(28.91,74.76) 28.91,74.61 29.81,73.71 30.38,73.71 ; 18.06,76.51 18.4,76.51 v6(18.93,75.98) 19.35,75.56 20.12,75.56
  vias: v6(25.72,75.76)
+3.3V: length 94.1
  Top Layer w0.508: 76.43,54.71 77.65,54.71 v4(77.72,54.64) ; 76.43,54.71 v4(73.91,54.71) ; 76.43,54.71 76.43,50.9 74.12,48.59 v4(67.59,48.59) ; v4(63.17,48.64) 63.17,48.59 67.59,48.59
  Bottom Layer w0.254: v4(73.91,54.71) 73.14,55.48 68.71,55.48 67.82,56.37 ; KEY1.1 71.99,34.09 71.48,33.58 67.23,33.58 66.8,34.01 66.8,42.49 68.61,44.3 68.61,47.78 69.13,47.78 70.3,48.95 72.48,48.95 72.94,48.48 ; 79.94,51.48 81.37,51.48 C37.2 ; U6.48 83.09,56.98 84.16,55.91
  Bottom Layer w0.381: v4(77.72,54.64) 78.26,54.64 79.1,55.48 80.76,55.48 81.48,54.76 83.02,54.76 84.16,55.91 85.22,54.85 85.22,50.02 C37.2
  Bottom Layer w0.508: U2.2 61.3,47.54 C35.2 ; 69.13,47.78 68.32,48.59 v4(67.59,48.59) ; 78.99,34.09 KEY1.1 ; v4(63.17,48.64) 61.56,47.03 61.43,47.03
+3V3: length 72.8
  Top Layer w0.4: v6(22.04,81.36) v6(25.96,81.36)
  Bottom Layer w0.2: 25.38,92.36 25.36,92.34 U3.10 25.36,90.41 ; 28.21,75.41 28.06,75.56 U103.48 26.36,75.56 26.31,75.51 ; 28.21,75.41 27.96,75.16 U103.49 26.26,75.16 ; 28.21,75.41 29.2,75.41 29.78,74.82 29.78,74.76 ; 25.36,85.11 U3.33 25.36,83.01 25.36,83.01 ; 19.71,87.21 19.96,87.46 U3.49 21.66,87.46 ; 19.71,87.21 19.86,87.06 U3.48 21.56,87.06 21.61,87.11 ; 19.71,87.21 18.72,87.21 18.14,87.79 18.14,87.86 ; 22.57,79.63 22.56,79.62 U103.33 22.56,77.51 ; 30.01,87.56 29.91,87.46 U3.22 27.06,87.46 ; 20.11,85.26 20.31,85.46 21.56,85.46 21.76,85.26 ; 21.76,84.22 21.76,85.01 21.71,85.06 20.92,85.06 ; 27.61,77.16 26.36,77.16 26.16,77.36 ; 27.6,77.17 27.79,77.36 ; 21.76,91.09 21.76,90.31 ; 27,77.56 26.21,77.56 26.16,77.61 26.16,78.39 ; 20.86,75.16 U103.22 18.89,75.16 18.54,75.51 18.06,75.51
  Bottom Layer w0.4: 20.99,84.22 20.99,84.95 20.99,84.96 ; 20.99,84.22 21.66,84.22 ; 20.99,84.22 20.99,83.01 20.05,83.01 ; 20.99,84.22 20.05,84.22 ; 27.91,78.39 27.91,77.48 27.79,77.36 ; 27.91,78.39 26.94,78.39 ; 27.91,78.39 28.77,78.39 29.34,78.96 29.81,78.96 ; 27.91,78.39 27.91,79.61 26.97,79.61 ; 26.97,79.61 26.94,79.64 26.94,80.45 26.02,81.36 v6(25.96,81.36) ; 26.97,79.61 26.94,79.58 26.94,78.39 ; 20.05,83.01 20.05,84.22 ; 20.05,83.01 20.05,81.42 19.99,81.36 ; 21.42,92.31 22.36,92.31 ; 21.42,92.31 21.41,92.3 21.41,91.34 21.66,91.09 ; 21.42,92.31 21.42,92.36 20.75,93.03 16.19,93.03 ; 26.94,78.39 26.94,77.71 ; 26.94,78.39 26.26,78.39 ; 19.99,81.36 18.24,81.36 18.14,81.26 ; 19.99,81.36 v6(22.04,81.36) ; 18.14,81.26 18.14,82.53 18.17,82.56 ; 18.14,81.26 18.09,81.21 ; 16.19,93.03 15.39,93.03 15.12,92.76 15.12,92.31 ; 16.19,93.03 16.19,92.36 ; 20.05,84.22 20.05,85.22 20.09,85.26 ; 20.05,84.22 18.95,84.22 18.34,83.61 18.15,83.61
+5V: length 90.4
  Top Layer w0.254: H1.1 40.76,82.61 40.7,82.66 41.03,82.66 55.19,68.51 ; 40.7,83 USB4.1
  Top Layer w0.4: v6(27.14,81.36) 26.44,82.06 22.74,82.06
  Bottom Layer w0.4: 34.82,81.36 40.76,81.36 ; 34.82,81.36 27.14,81.36 ; 34.82,81.36 35.25,81.78 C12.1 C20.1 ; 40.76,81.36 C25.1 C26.1 ; 40.76,81.36 40.76,83.01 40.81,83.01 ; 16.19,79.01 16.19,77.66 16.09,77.56 ; USB1.1 11.61,77.56 16.09,77.56 ; 80.81,83.01 80.1,83.72 76.95,83.72 76,84.68 73.39,84.68 ; v6(22.74,82.06) 22.74,80.76 22.44,80.46 19.39,80.46 18.09,79.16 18.09,79.01 17.99,78.91 17.99,77.59 17.96,77.56 16.09,77.56 ; 53.46,84.68 56.06,84.68 57.72,83.01 60.81,83.01
GND: length 451.7
  Top Layer w0.2: v6(29.66,70.31) v6(34.59,70.31)
  Top Layer w0.4: v3(54.6,75.21) 59.68,75.21 v3(62.47,72.42) ; 40.7,83.09 40.76,85.37 43.55,88.17 59.04,88.17 60.7,86.51 60.7,83.03 ; 80.7,83.03 80.7,75.78 v3(79.36,74.45) ; 60.81,83.01 60.81,86.63 62.35,88.17 80,88.17 80.89,87.28 80.89,83.09 80.81,83.01
  Top Layer w0.508: v4(54.94,30.02) 54.97,30 54.97,14.48 v5(54.98,14.47)
  Bottom Layer w0.2: 22.56,72.21 22.56,70.3 22.54,70.28 ; 26.16,71.52 26.16,72.31 ; 20.12,73.96 19.59,73.96 19.09,73.45 v6(19.09,73.26) ; 31.74,71.31 32.21,71.31 32.41,71.51 32.41,72.26 31.97,72.7 29.56,72.7 28.3,73.96 27,73.96 ; 31.74,71.81 31.51,71.81 31.02,72.3 29.39,72.3 28.13,73.56 27,73.56 ; 31.74,70.81 32.29,70.81 32.81,71.33 32.81,72.42 32.14,73.1 29.72,73.1 28.46,74.36 27,74.36 ; 35.24,71.61 35.66,71.61 36.42,70.85 36.42,70.31 ; 30.31,71.66 v6(29.81,71.66) 29.66,71.81 28.89,71.81 ; 20.12,74.36 19.34,74.36 18.49,73.51 18.49,72.64 18.89,72.24 18.36,71.71 17.51,71.71 ; 27,73.16 27.7,73.16 28.21,72.64 28.21,71.48 28.39,71.31 28.89,71.31 ; v6(29.66,70.31) 27.52,70.31 27.26,70.57 27.26,71.56 27,71.82 27,72.36 ; 15.76,71.71 15.94,71.71 17.34,73.11 17.51,73.11 ; 28.89,70.81 28.32,70.81 27.81,71.32 27.81,72.48 27.53,72.76 27,72.76 ; 19.04,90.81 18.26,90.81 v6(18.11,90.96) 17.61,90.96 ; v6(34.59,70.31) 35.4,70.31 ; 32.16,91.31 31.93,91.31 30.53,89.91 30.41,89.91 ; v6(28.84,89.36) 28.84,89.16 28.33,88.66 27.8,88.66
  Bottom Layer w0.254: 51.32,70 50.53,70 49.52,71.02 49.52,73.48 ; 52.06,73.48 52.06,72.16 52.95,71.27 55.55,71.27 ; 55.55,69.24 53.96,69.24 50.79,72.42 50.79,73.48 ; 48.25,73.48 48.25,70.89 47.36,70 46.44,70
  Bottom Layer w0.381: 77.94,55.74 U6.47 ; 77.94,55.74 77.64,55.74 76.35,54.46 76.35,53.18 ; 77.94,55.74 78.55,55.74 79.07,56.26 81.8,56.26 82.16,55.91 ; 78.79,51.97 76.73,51.97 76.35,52.35 76.35,53.18 ; 78.79,51.97 79.94,51.98 82.87,51.98 84.02,50.83 ; 78.79,51.97 78.79,49.48 79.15,49.12 79.15,46.57 R2.1 ; 73.76,53.18 76.35,53.18 ; 73.76,53.18 73.76,52.58 73.44,52.26 73.44,47.61 73.1,47.27 71.64,47.27 C36.1 ; 73.76,53.18 73.76,53.7 72.48,54.98 68.87,54.98 68.27,54.37 C32.1
  Bottom Layer w0.4: v6(19.79,71.26) 19.77,71.28 18.89,71.28 18.37,70.76 16.44,70.76 15.76,71.43 15.76,71.71 15.24,71.71 14.69,72.26 14.69,73.79 15.36,74.46 15.36,75.38 v6(15.39,75.41) ; 19.09,83.01 19.09,82.2 v6(19.14,82.16) ; v6(20.79,79.63) 21.6,79.63 21.61,79.63 ; v6(33.79,71.08) 33.79,70.33 33.77,70.31 ; 79.5,69.75 79.5,72.23 79.44,72.29 ; 17.18,87.86 v6(16.39,87.86) ; v6(16.44,82.56) 17.21,82.56 17.19,82.54 17.19,79.06 17.14,79.01 ; v3(54.6,75.21) 54.6,73.48 ; 28.87,79.61 28.89,79.63 v6(28.89,80.41) ; 26.01,79.61 26.01,80.33 v6(26.04,80.36) ; 31.74,69.59 27.16,69.59 26.5,70.25 26.5,70.31 ; 31.74,69.59 32.54,69.59 32.81,69.85 32.81,70.31 ; 31.74,69.59 31.74,70.26 ; v3(62.47,72.42) 62.54,72.35 79.38,72.35 79.44,72.29 ; v6(14.16,91.56) 14.16,91.56 14.16,92.31 ; 26.5,70.31 26.51,70.32 26.51,71.3 26.28,71.53 ; 26.5,70.31 25.57,70.31 ; 30.71,77.96 v6(31.53,77.96) ; 31.34,73.71 v6(32.13,73.71) ; 79.44,72.29 79.44,74.37 ; v6(18.94,78.31) 18.92,78.29 18.92,77.56 ; 23.32,92.31 v6(24.06,92.31) ; 30.74,74.76 v6(31.53,74.76) ; SW2.1 v6(35.24,88.71) ; 16.58,88.91 v6(15.79,88.91) ; v6(16.29,75.51) 17.1,75.51 ; v6(28.24,91.36) 28.26,91.34 29.04,91.34 29.04,91.86 29.44,92.26 31.69,92.26 32.16,91.78 32.16,91.31 32.63,91.31 33.24,90.7 33.24,88.88 32.92,88.56 32.92,87.79 v6(32.89,87.76) ; v6(22.74,83.01) 21.95,83.01 ; v6(31.54,78.96) 30.77,78.96 ; v6(16.29,76.51) 17.1,76.51 ; v6(31.79,86.56) 30.97,86.56 ; v6(31.79,87.56) 30.97,87.56 ; SW102.1 v6(35.24,73.91) ; v6(20.73,70.28) 21.58,70.28 ; 24.61,70.31 v6(23.86,70.31) ; v6(27.17,92.36) 26.34,92.36 ; 17.19,83.61 v6(16.37,83.61) ; 17.18,84.66 v6(16.37,84.66) ; v6(27.14,83.01) 26.32,83.01
  Bottom Layer w0.508: 59.44,49.38 55.75,53.06 50.27,53.06 48.74,54.58 ; 59.44,49.38 61.65,49.38 64.08,51.82 64.08,52.28 64.07,52.29 ; 59.44,49.38 57.45,47.39 57.2,47.39 ; 59.44,49.38 59.47,49.41 61.43,49.41 ; C32.1 67.45,54.37 ; J2.3 92.69,14.46 88.08,14.46 ; 54.94,34.09 KEY2.1 51.74,35.7 51.74,38.15 53.19,39.6 54.81,39.6 57.2,41.99 57.2,47.39 ; 54.94,34.09 59.94,34.09 ; 54.94,34.09 v4(54.94,30.02) ; 49.98,13.05 49.98,14.47 ; 49.98,14.47 55.39,14.47 C41.1 57.88,14.46 69.03,14.46 ; 49.98,14.47 38.84,14.47 C40.1 36.31,14.5 30.93,14.5 ; 30.93,14.5 19.82,14.5 C39.1 17.22,14.49 11.88,14.49 ; 30.93,14.5 30.93,13.05 ; 69.03,13.05 69.03,14.46 ; 69.03,14.46 74.75,14.46 C42.1 77.24,14.46 88.08,14.46 ; 57.2,47.39 C34.1 ; 11.88,13.05 11.88,14.49 ; 11.88,14.49 2.27,14.49 2.13,14.63 J1.3 ; 88.08,13.05 88.08,14.46
  vias: v3(5.44,93.7) v3(5.44,88.62) v3(5.44,83.54) v3(5.44,78.46) v3(5.44,73.38) v3(5.44,68.3) v3(5.44,53.06) v3(5.44,42.9) v3(5.44,32.74) v3(5.44,27.66) v3(5.44,5.44) v3(10.52,93.7) v3(10.52,83.54) v3(10.52,73.38) v3(10.52,53.06) v3(10.52,42.9) v3(10.52,22.58) v3(15.6,68.3) v3(15.6,58.14) v3(15.6,53.06) v3(15.6,27.66) v3(20.68,68.3) v3(20.68,63.22) v3(20.68,53.06) v3(20.68,42.9) v3(20.68,27.66) v3(20.68,5.44) v3(22.43,76.11) v3(22.43,74.96) v3(22.43,73.83) v3(23.23,88.81) v3(23.23,87.66) v3(23.23,86.53) v3(23.56,76.11) v3(23.56,74.96) v3(23.56,73.83) v3(24.36,88.81) v3(24.36,87.66) v3(24.36,86.53) v3(24.72,76.11) v3(24.72,74.96) v3(24.72,73.83) v3(25.52,88.81) v3(25.52,87.66) v3(25.52,86.53) v3(25.76,68.3) v3(25.76,53.06) v3(25.76,42.9) v3(25.76,32.74) v3(25.76,5.44) v3(30.84,83.54) v3(30.84,68.3) v3(30.84,58.14) v3(30.84,53.06) v3(30.84,32.74) v3(30.84,27.66) v3(35.92,93.7) v3(35.92,73.38) v3(35.92,68.3) v3(35.92,58.14) v3(35.92,53.06) v3(35.92,32.74) v3(35.92,27.66) v3(41,93.7) v3(41,88.62) v3(41,63.22) v3(46.08,93.7) v3(46.08,88.62) v3(46.08,78.46) v3(46.08,73.38) v3(46.08,68.3) v3(46.08,53.06) v3(46.08,42.9) v3(51.16,93.7) v3(51.16,88.62) v3(51.16,83.54) v3(51.16,68.3) v3(51.16,58.14) v3(51.16,32.74) v3(51.16,27.66) v3(53.33,72.04) v3(56.24,93.7) v3(56.24,88.62) v3(56.24,58.14) v3(56.24,32.74) v3(56.24,27.66) v3(61.32,93.7) v3(61.32,88.62) v3(61.32,78.46) v3(61.32,73.38) v3(61.32,68.3) v3(61.32,5.44) v3(66.4,93.7) v3(66.4,88.62) v3(66.4,78.46) v3(66.4,68.3) v3(66.4,58.14) v3(66.4,22.58) v3(71.48,93.7) v3(71.48,88.62) v3(71.48,83.54) v3(71.48,78.46) v3(71.48,73.38) v3(71.48,68.3) v3(71.48,58.14) v3(73.94,33.12) v3(74.04,39.14) v3(76.56,93.7) v3(76.56,88.62) v3(76.56,78.46) v3(76.56,73.38) v3(76.56,5.44) v3(81.64,93.7) v3(81.64,88.62) v3(81.64,78.46) v3(81.64,5.44) v3(86.72,93.7) v3(86.72,88.62) v3(86.72,16.94) v3(87.98,21.66) v3(88.82,54.71) v3(88.82,49.63) v3(91.8,83.54) v3(91.8,78.46) v3(91.8,16.94) v3(93.09,39.32)
VBUS: length 12.7
  Top Layer w0.4: v3(85.71,74.41) v3(85.71,78.89)
  Bottom Layer w0.4: v3(85.71,74.41) 85.68,74.41 83.55,72.29 F1.2 ; v3(85.71,78.89) 85.75,78.93 86.82,78.93 87.97,77.78 89.18,77.78 USB5.1
VCC: length 159.5
  Top Layer w0.508: v4(42.57,33.99) 39.38,30.8 39.38,9.82 v5(39.39,9.82)
  Bottom Layer w0.508: J2.1 92.78,9.84 82.48,9.84 ; 82.48,9.84 82.48,11.25 ; 82.48,9.84 77.38,9.84 C42.2 75.87,11.22 74.47,9.82 63.43,9.82 ; 44.38,9.82 55.23,9.82 C41.2 58.04,9.82 63.43,9.82 ; 44.38,9.82 44.38,11.25 ; 44.38,9.82 38.99,9.82 C40.2 36.15,9.77 25.33,9.77 ; 25.33,11.25 25.33,9.77 ; 25.33,9.77 19.94,9.77 C39.2 17.16,9.83 6.28,9.83 ; 63.43,9.82 63.43,11.25 ; 6.28,9.83 6.28,11.25 ; 6.28,9.83 1.58,9.83 J1.1 ; 56.94,48.49 56.05,49.39 C34.2 54.86,49.86 52.66,52.06 C31.2 44.17,47.13 44.17,44.07 42.57,42.47 v4(42.57,33.99)
1D+: length 4.5
  Bottom Layer w0.2: 33.16,78.75 32.83,78.42 32.83,76.94 32.05,76.16 31.12,76.16 30.77,75.81
1D-: length 4.4
  Bottom Layer w0.2: 30.77,76.89 31.1,76.56 31.89,76.56 32.44,77.11 32.44,79.06 32.76,79.39
1XOUT: length 2
  Bottom Layer w0.2: 20.12,74.76 18.6,74.76 18.3,74.46
$C1_2: length 39.7
  Top Layer w0.254: v1(59.18,45.52) 61.49,47.83 74.19,47.83 77.19,50.83 v1(77.19,52.65)
  Bottom Layer w0.254: v1(77.19,52.65) 77.36,52.48 79.94,52.48 ; KEY2.4 58.04,37.79 ; 58.04,37.79 58.04,41.66 59.18,42.8 v1(59.18,45.52) ; 58.04,37.79 KEY2.3
$C19_1: length 2.3
  Bottom Layer w0.2: 31.05,88.56 31.96,88.56 31.96,89.7 32.16,89.91
$C119_1: length 2.5
  Bottom Layer w0.2: 15.76,73.11 15.76,73.83 16.32,74.39 16.32,74.46 17.28,74.46
$D1_1: length 35
  Top Layer w0.254: v3(56.73,66.68) 56.55,66.5 56.55,66.44 55.85,65.74 54.8,65.74 54.34,66.2 50.73,66.2 49.58,67.35 41.49,67.35 H1.3
  Bottom Layer w0.254: 64.07,54.69 62.47,54.69 61.79,54.01 61.36,54.01 58.01,57.35 58.01,59.74 57.33,60.43 57.33,63.83 56.73,64.43 v3(56.73,66.68)
$D2_1: length 33
  Top Layer w0.254: v3(55.97,66.68) 55.77,66.49 55.77,66.44 55.43,66.1 54.95,66.1 54.48,66.56 50.92,66.56 49.77,67.7 43.68,67.7 H1.2
  Bottom Layer w0.254: v3(55.97,66.68) 55.97,64.33 56.79,63.5 56.79,60.35 57.53,59.61 57.53,55.89 56.64,55 56.64,54.64 57.28,54.01 R8.1
$D3_2: length 27.2
  Bottom Layer w0.254: 10.71,37.21 14.78,41.29 14.78,44.2 16.64,46.05 SW1.1
$D4_2: length 27.9
  Bottom Layer w0.254: 29.76,37.21 29.95,37.21 33.91,41.17 33.91,44.27 34.67,45.03 34.67,61.98 SW21.1
$D5_2: length 28.7
  Top Layer w0.254: v1(53.67,49.78) v1(53.67,53.85)
  Bottom Layer w0.254: v1(53.67,53.85) 53.62,53.85 53.62,61.98 SW3.1 ; v1(53.67,49.78) 49.66,45.77 49.66,44.35 48.31,43 48.31,37.21 48.81,37.21
$D6_2: length 34.3
  Top Layer w0.254: v1(71.98,43.23) 72.21,43.23 80.11,51.13 80.11,58.01 77.8,60.33 v1(74.8,60.33)
  Bottom Layer w0.254: 67.86,37.21 71.98,41.34 v1(71.98,43.23) ; SW4.1 73.79,61.34 v1(74.8,60.33)
$D7_2: length 28.2
  Top Layer w0.254: v1(90.75,55.27) 90.75,58.39 v1(90.73,58.39)
  Bottom Layer w0.254: 86.91,37.21 87.12,37.21 91.03,41.12 91.03,44.09 91.69,44.76 91.69,46.18 90.75,47.12 v1(90.75,55.27) ; v1(90.73,58.39) 90.73,59.74 92.84,61.85 SW5.1
$D8_2: length 10.7
  Bottom Layer w0.254: SW6.1 16.64,40.6 10.71,34.67
$D9_2: length 11.5
  Bottom Layer w0.254: SW7.1 34.59,42.93 34.59,39.29 29.97,34.67 29.76,34.67
$D10_2: length 11.4
  Bottom Layer w0.254: 48.81,34.67 48.81,35.1 49.96,35.1 51,36.14 51,38.96 54.74,42.7 SW8.1
$D11_2: length 11.3
  Bottom Layer w0.254: SW9.1 72.72,42.93 72.72,41.43 68.89,37.59 68.89,35.7 67.86,34.67
$D12_2: length 10.7
  Bottom Layer w0.254: 86.91,34.67 92.84,40.6 SW10.1
$D13_2: length 8.3
  Bottom Layer w0.254: SW11.1 16.42,23.88 10.71,18.16
$D14_2: length 8.3
  Bottom Layer w0.254: 29.76,18.16 29.92,18.16 35.64,23.88 SW12.1
$D15_2: length 8.3
  Bottom Layer w0.254: 48.81,18.16 49.02,18.16 SW13.1
$D16_2: length 8.3
  Bottom Layer w0.254: SW14.1 73.71,23.88 68,18.16 67.86,18.16
$D17_2: length 8.4
  Bottom Layer w0.254: 86.93,18.24 87.27,18.24 92.91,23.88 SW15.1
$D18_2: length 14.2
  Top Layer w0.254: v1(15.8,6.66) 15.8,11.63 v1(11.89,15.55)
  Bottom Layer w0.254: v1(15.8,6.66) 15.8,5.11 16.08,4.83 SW16.1 ; v1(11.89,15.55) 11.81,15.62 10.71,15.62
$D19_2: length 13.8
  Top Layer w0.254: v1(35.1,7.09) 35.1,11.18 v1(31.06,15.21)
  Bottom Layer w0.254: SW17.1 35.1,5.41 v1(35.1,7.09)
  Bottom Layer w0.381: v1(31.06,15.21) 30.66,15.62 29.76,15.62
$D20_2: length 13.8
  Top Layer w0.254: v1(53.85,6.68) 53.85,11.53 v1(50.14,15.24)
  Bottom Layer w0.254: v1(53.85,6.68) 53.85,5.72 SW18.1
  Bottom Layer w0.381: 48.81,15.62 49.76,15.62 v1(50.14,15.24)
$D21_2: length 13.8
  Top Layer w0.254: v1(73.13,6.71) 73.13,11.3 v1(69.14,15.29)
  Bottom Layer w0.254: SW19.1 73.13,5.49 v1(73.13,6.71)
  Bottom Layer w0.381: 67.86,15.62 68.81,15.62 v1(69.14,15.29)
$D22_2: length 15.1
  Top Layer w0.254: v1(91.74,6.78) 91.74,9.79 85.92,15.62 v1(85.67,15.62)
  Bottom Layer w0.254: v1(91.74,6.78) 91.74,5.92 SW20.1
  Bottom Layer w0.381: v1(85.67,15.62) 86.91,15.62
$FUSE1_1: length 16
  Top Layer w0.254: v3(55.19,66.68) 55.19,68.51
  Bottom Layer w0.508: 51.38,54.06 52.91,55.59 52.91,63.26 55.19,65.54 v3(55.19,66.68)
$J1_2: length 5.4
  Bottom Layer w0.508: J1.2 2.25,13.05 6.28,13.05
$KEY1_3: length 29.5
  Top Layer w0.254: v1(76.45,55.6) 78,55.6 78.54,55.07 78.54,50.34 75.41,47.22 v1(75.29,47.22)
  Bottom Layer w0.254: KEY1.3 76.61,37.8 ; 76.61,37.8 76.61,37.79 KEY1.4 ; 76.61,37.8 76.61,45.38 75.29,46.7 v1(75.29,47.22) ; v1(76.45,55.6) 76.44,55.61 U6.44
$LED1_1: length 1.9
  Bottom Layer w0.254: R1.2 80.98,69.72 80.98,67.85
$R3_2: length 2.8
  Bottom Layer w0.2: 18.17,86.81 18.32,86.66 20.92,86.66
$R4_2: length 3
  Bottom Layer w0.2: 20.92,86.26 19.31,86.26 18.78,85.73 18.17,85.73
$R6_2: length 1.5
  Bottom Layer w0.2: SW2.2 35.24,91.87 34.8,92.31
$R103_2: length 2.8
  Bottom Layer w0.2: 27,75.96 29.6,75.96 29.75,75.81
$R104_2: length 3
  Bottom Layer w0.2: 27,76.36 28.62,76.36 29.15,76.89 29.75,76.89
$U8_2: length 14.2
  Bottom Layer w0.254: 82.48,13.05 81.65,12.22 70,12.22 69.03,11.25
$U10_2: length 14.2
  Bottom Layer w0.254: 30.93,11.25 31.9,12.22 43.55,12.22 44.38,13.05
$U10_4: length 14.2
  Bottom Layer w0.254: 63.43,13.05 62.6,12.22 50.95,12.22 49.98,11.25
$U11_2: length 14.2
  Bottom Layer w0.254: 25.33,13.05 24.47,12.19 12.82,12.19 11.88,11.25
COL1: length 85.2
  Top Layer w0.254: v2(74.6,52.53) 67.23,52.53 62.26,57.51 12.47,57.51 6.22,63.75 6.22,64.97 2.87,68.33 NOREF#3.1
  Bottom Layer w0.254: 75.94,48.48 75.94,51.19 v2(74.6,52.53)
COL2: length 83.7
  Top Layer w0.254: v2(74.12,51.92) 67.21,51.92 62.08,57.05 12.24,57.05 5.74,63.55 5.74,64.8 4.24,66.29 NOREF#2.2
  Bottom Layer w0.254: v2(74.12,51.92) 74.47,51.92 75.44,50.95 75.44,48.48
COL3: length 81.4
  Top Layer w0.254: NOREF#28.3 2.13,64.26 3.25,63.14 5.46,63.14 12.01,56.59 61.9,56.59 67.31,51.18 v1(74.35,51.18)
  Bottom Layer w0.254: v1(74.35,51.18) 74.94,50.58 74.94,48.48
COL4: length 82.8
  Top Layer w0.254: NOREF#5.4 61.7,56.13 67.26,50.57 74.68,50.57 75.18,51.08 75.18,53.42 v1(74.75,53.85)
  Bottom Layer w0.254: U6.39 73.94,56.08 74.75,55.27 v1(74.75,53.85)
COL5: length 84.3
  Top Layer w0.254: v1(75.67,53.85) 75.72,53.8 75.72,51 74.83,50.11 67.08,50.11 61.47,55.73 2.9,55.73 NOREF#4.1
  Bottom Layer w0.254: U6.40 74.44,56.24 75.67,55.02 v1(75.67,53.85)
COL6: length 136.8
  Top Layer w0.254: NOREF#27.2 92.28,68.33 87.05,63.09 87.05,57.35 70.69,41 67.13,41 64.11,44.02 58.62,44.02 53.8,48.84 4.5,48.84 NOREF#19.2
  Bottom Layer w0.254: NOREF#27.2 92.15,68.33 91.52,67.69 80.29,67.69 75.46,62.87 75.46,58.7 74.94,58.18 U6.41
COL7: length 133.6
  Top Layer w0.254: NOREF#32.3 1.78,50.04 3.4,48.41 53.49,48.41 58.34,43.56 63.96,43.56 66.95,40.56 70.89,40.56 91.67,61.34 91.67,65.02 NOREF.3
  Bottom Layer w0.254: NOREF.3 92.48,66.29 91.54,67.23 80.49,67.23 75.9,62.64 75.9,58.42 75.44,57.97 U6.42
COL8: length 131.5
  Top Layer w0.254: NOREF#26.4 53.21,48.01 58.12,43.1 63.78,43.1 66.75,40.13 71.04,40.13 92.94,62.03 NOREF#23.4
  Bottom Layer w0.254: NOREF#23.4 92.94,64.52 90.65,66.8 80.64,66.8 76.33,62.48 76.33,58.17 75.94,57.78 75.94,56.98
COL9: length 127.2
  Top Layer w0.254: NOREF#21.1 1.27,42.9 5.87,38.3 69.83,38.3 84.61,53.09 89.89,53.09 NOREF#17.1
  Bottom Layer w0.254: U6.45 76.94,57.78 76.78,57.94 76.78,60.93 77.62,61.77 85.9,61.77 90.98,56.69 92.94,56.69 NOREF#17.1
COL10: length 121.2
  Top Layer w0.254: NOREF#14.2 91.39,52.55 84.66,52.55 69.95,37.85 NOREF#13.2
  Bottom Layer w0.254: NOREF#14.2 85.67,61.37 77.85,61.37 77.27,60.78 77.27,58.04 77.44,57.86 U6.46
COL11: length 161.8
  Top Layer w0.254: NOREF#9.3 84.81,52.07 76,43.26 v1(76,43) 75.87,43 70.21,37.34 2.67,37.34 v1(2.67,37.19) 2.67,19.56 v1(2.64,19.53) v1(2.64,4.67)
  Bottom Layer w0.254: v1(76,43) 76,44.27 74.44,45.83 74.44,48.48 ; SW16.2 2.64,2.31 v1(2.64,4.67) ; v1(2.64,19.53) 2.67,19.56 SW11.2 ; SW1.2 SW6.2 v1(2.67,37.19)
COL12: length 171.6
  Top Layer w0.254: NOREF#12.1 87.15,44.25 87.15,39.09 82.83,34.77 v1(69.57,34.77) 28.96,34.77 21.72,27.53 v1(21.72,23.42) v1(21.72,4.22)
  Bottom Layer w0.254: SW17.2 v1(21.72,4.22) ; SW12.2 v1(21.72,23.42) 21.72,27.53 27.56,33.38 27.56,37.95 27.07,38.44 23.66,38.44 SW7.2 SW21.2 ; v1(69.57,34.77) 69.57,37.59 73.13,41.15 75.01,41.15 75.39,41.53 75.39,44.3 73.94,45.74 73.94,48.48
COL13: length 151
  Top Layer w0.254: NOREF#11.2 91.69,46.76 91.69,42.85 83.01,34.16 v1(61.9,34.16) 47.7,34.16 40.74,27.2 v1(40.74,23.42) 40.74,4.45 v1(40.77,4.42)
  Bottom Layer w0.254: v1(61.9,34.16) 61.75,34.32 61.75,41.73 63.37,43.36 63.37,46.86 66.49,49.98 U6.25 ; v1(40.74,23.42) 40.74,21.36 SW13.2 SW8.2 SW3.2 ; v1(40.77,4.42) 40.77,2.26
COL14: length 117.5
  Top Layer w0.254: v1(61.19,55.04) 63.98,52.25 v1(63.98,50.47) ; v1(59.82,4.47) v1(59.82,23.24) 59.82,27.2 66.32,33.71 83.24,33.71 92.94,43.41 NOREF#22.3
  Bottom Layer w0.254: v1(59.82,4.47) SW19.2 ; SW4.2 61.19,58.06 v1(61.19,55.04) ; SW14.2 v1(59.82,23.24) 59.82,31.9 61.21,33.3 61.21,38.99 SW9.2 62.94,43.51 62.94,47.19 63.98,48.23 v1(63.98,50.47) 71.44,50.47 U6.26
COL15: length 119.8
  Top Layer w0.254: NOREF#29.2 88.19,37.85 78.87,28.52 v1(78.87,23.39) v1(78.87,4.52) ; v1(72.67,53.19) 72.67,54.66 75.67,57.66 v1(79.4,57.66)
  Bottom Layer w0.254: SW5.2 79.4,58.9 v1(79.4,57.66) 79.63,57.43 84.96,57.43 87.63,54.76 87.63,44.27 85.67,42.32 85.67,34.24 86.21,33.71 88.16,33.71 92.3,37.85 NOREF#29.2 ; SW15.2 v1(78.87,23.39) 78.87,32 80.37,33.5 80.37,38.33 79.93,38.76 79.93,40.39 SW10.2 ; U6.27 72.32,50.98 72.54,51.21 72.54,53.19 v1(72.67,53.19) ; v1(78.87,4.52) SW20.2
CTS1RTS: length 5.8
  Bottom Layer w0.2: 23.36,84.22 23.36,78.39
D+: length 19.8
  Bottom Layer w0.2: USB1.3 11.39,82.31 14.69,82.31 15.09,82.71 15.09,85.22 16.32,86.46 16.8,86.46 17.15,86.81
  Bottom Layer w0.254: 61.54,52.06 62.87,53.39 69.26,53.39 69.86,53.98 U6.33
D-: length 25.3
  Bottom Layer w0.2: USB1.2 11.39,80.3 14.93,80.3 15.49,80.86 15.49,85.06 16.49,86.06 16.82,86.06 17.15,85.73
  Bottom Layer w0.254: 59,52.01 59.97,51.04 62.4,51.04 62.84,51.49 62.84,52.6 63.22,52.98 69.54,52.98 70.04,53.48 U6.32
DM: length 33.6
  Bottom Layer w0.254: U1.9 59.22,73.48 62.87,77.13 89.18,77.13 USB5.2
DM1: length 29.7
  Bottom Layer w0.254: 83.31,83.01 81.22,80.93 56.38,80.93 55.87,80.42 U1.7
DM2: length 12.8
  Bottom Layer w0.254: U1.5 53.33,80.67 54.6,81.94 62.85,81.94 63.31,82.39 63.31,83.01
DM3: length 25.4
  Top Layer w0.254: 53.99,72.36 43.26,83.09 USB4.2
  Bottom Layer w0.254: U1.3 50.79,80.8 50.53,81.05 45.07,81.05 43.2,83.09
DM4: length 19.7
  Bottom Layer w0.2: 37.07,79.4 37.06,79.39 32.76,79.39
  Bottom Layer w0.254: 37.07,79.4 38.09,79.4 41.01,76.48 48.12,76.48 48.63,76.99 48.63,78.26 48.25,78.64 U1.1
DP: length 36.1
  Bottom Layer w0.254: U1.10 55.87,72.54 56.12,72.29 58.79,72.29 62.98,76.48 89.18,76.48 USB5.3
DP1: length 30.1
  Bottom Layer w0.254: U1.8 57.14,79.91 57.65,80.42 82.71,80.42 85.31,83.01
DP2: length 13.9
  Bottom Layer w0.254: 65.31,83.01 65.31,81.86 64.89,81.43 55.23,81.43 54.6,80.8 U1.6
DP3: length 10.9
  Top Layer w0.254: 45.2,81.66 45.2,83.09 USB4.3
  Bottom Layer w0.254: U1.4 52.06,80.8 51.3,81.56 46.6,81.56 45.2,83.09
DP4: length 20
  Bottom Layer w0.2: 37.07,78.77 37.06,78.75 33.16,78.75
  Bottom Layer w0.254: U1.2 49.52,78.64 49.14,78.26 49.14,76.86 48.25,75.97 40.88,75.97 38.09,78.77 37.07,78.77
NRGB: length 73.6
  Top Layer w0.254: v1(79.65,17.78) 84.71,17.78 90.3,12.19 J2.2
  Bottom Layer w0.254: v1(79.65,17.78) 79.22,17.78 77.06,19.94 77.06,24.21 68.17,33.1 67.01,33.1 66.34,33.76 66.34,41.78 63.8,44.32 63.8,46.61 66.7,49.51 72.37,49.51 72.95,50.09 72.95,52.53 73.28,52.86 73.28,53.47 72.27,54.48 U6.34
  Bottom Layer w0.508: 88.08,11.25 92.02,11.25 J2.2
QSPI_SCLK: length 7.6
  Bottom Layer w0.2: 16.19,91.31 15.71,91.31 15.51,91.11 15.51,90.36 15.95,89.91 18.37,89.91 19.63,88.66 20.92,88.66
QSPI_SD0: length 5.5
  Bottom Layer w0.2: 16.19,90.81 16.41,90.81 16.9,90.31 18.57,90.31 19.83,89.06 20.92,89.06
QSPI_SD1: length 3.4
  Bottom Layer w0.2: 19.04,91.81 19.6,91.81 20.11,91.3 20.11,90.07 20.33,89.86 20.92,89.86
QSPI_SD2: length 3.4
  Bottom Layer w0.2: 20.92,89.46 20.16,89.46 19.71,89.91 19.71,91.13 19.54,91.31 19.04,91.31
QSPI_SD3: length 9
  Bottom Layer w0.2: 16.19,91.81 15.64,91.81 15.11,91.27 15.11,90.19 15.79,89.52 18.2,89.52 19.46,88.26 20.92,88.26
QSPI_SS: length 20.7
  Top Layer w0.2: v6(32.94,93.16) 19.11,93.16 v6(18.26,92.31)
  Bottom Layer w0.2: 20.92,90.26 20.91,90.27 20.91,90.81 20.66,91.06 20.66,92.05 20.4,92.31 U5.1 v6(18.26,92.31) ; 33.78,92.31 33.74,92.31 32.94,93.11 v6(32.94,93.16)
ROW1: length 122
  Top Layer w0.254: v3(82.8,36.3) 82.5,35.99 v2(63.73,35.99) v2(44.09,35.99) 25.43,35.99 v1(25.37,35.94)
  Bottom Layer w0.254: NOREF#24.1 5.93,35.81 7.33,37.21 7.87,37.21 7.87,35.79 9.91,33.76 23.19,33.76 v1(25.37,35.94) ; 83.52,37.21 83.52,37.02 v3(82.8,36.3) ; 83.52,37.21 85.14,38.84 85.14,41.81 82.63,44.32 82.63,49.38 81.02,50.98 U6.10 ; 83.52,37.21 85.17,35.57 85.17,34.01 85.95,33.22 90.35,33.22 NOREF#7.1
  Bottom Layer w0.381: v2(63.73,35.99) 63.73,36.47 64.47,37.21 ; 26.37,37.21 26.37,36.94 v1(25.37,35.94) ; v2(44.09,35.99) 45.31,37.21 45.42,37.21
ROW2: length 117.9
  Top Layer w0.254: v1(25.35,34.67) 26.09,35.41 v2(46.33,35.41) v2(62.99,35.41) v2(82.17,35.41)
  Bottom Layer w0.254: v1(25.35,34.67) 23.98,33.3 8.7,33.3 7.33,34.67 6.44,33.78 NOREF#15.2 ; NOREF#33.2 91.8,32.64 85.55,32.64 83.52,34.67 ; v2(82.17,35.41) 82.17,37.64 82.91,38.38 83.29,38.38 84.66,39.75 84.66,41.53 82.19,43.99 82.19,49 80.71,50.48 U6.11
  Bottom Layer w0.381: v2(82.17,35.41) 82.91,34.67 83.52,34.67 ; 64.47,34.67 64.08,34.67 63.35,35.41 v2(62.99,35.41) ; 45.42,34.67 45.59,34.67 v2(46.33,35.41) ; v1(25.35,34.67) 26.37,34.67
ROW3: length 141.3
  Bottom Layer w0.254: NOREF#16.3 1.27,31.7 2.46,30.51 2.46,25.37 4.65,23.19 4.65,20.55 6.63,18.57 7.33,18.57 7.33,18.13 8.2,17.25 25.46,17.25 26.37,18.16 27.44,17.09 44.36,17.09 45.42,18.16 46.57,17.02 63.33,17.02 64.47,18.16 65.51,17.12 82.41,17.12 86.82,21.53 86.82,24.49 87.91,25.58 87.91,32.11 ; 87.91,32.11 92.58,32.11 NOREF#35.3 ; 87.91,32.11 84.23,32.11 81.33,35 81.33,38.91 80.82,39.42 80.82,42.95 81.71,43.84 81.71,48.49 80.22,49.98 U6.12
ROW4: length 144.7
  Top Layer w0.254: NOREF#10.4 91.19,31.47 v1(84.3,31.47)
  Bottom Layer w0.254: NOREF#10.4 92.94,27.03 91.01,25.1 91.01,22.73 87.68,19.41 86.16,19.41 85.22,18.47 85.22,17.31 83.52,15.62 82.56,16.59 65.44,16.59 64.48,15.62 63.59,16.51 46.31,16.51 45.43,15.62 45.43,15.74 44.65,16.51 27.26,16.51 26.38,15.62 ; v1(84.3,31.47) 84.12,31.47 80.82,34.77 80.82,38.66 80.42,39.07 80.42,41.81 77.32,44.91 77.32,46.56 78.44,47.68 78.44,48.48 ; 26.37,15.62 25.36,16.64 8.31,16.64 7.33,15.66 7.33,15.62 4.22,18.73 4.22,22.96 1.27,25.91 NOREF#18.4
RTS1CTS: length 5.8
  Bottom Layer w0.2: 24.56,84.22 24.56,78.39
RX1TX: length 5.8
  Bottom Layer w0.2: 23.76,84.22 23.76,78.39
SWCLK: length 11.8
  Bottom Layer w0.2: 25.36,78.39 25.36,81.73 25.59,81.96 27.55,81.96 28.94,83.34 28.94,86.22 28.5,86.66 27.8,86.66
SWD: length 11.1
  Bottom Layer w0.2: 24.96,78.39 24.96,81.9 25.42,82.36 27.39,82.36 28.54,83.51 28.54,86.06 28.34,86.26 27.8,86.26
TX1RX: length 5.8
  Bottom Layer w0.2: 24.16,84.22 24.16,78.39
XIN: length 5.2
  Bottom Layer w0.2: 27.8,88.26 28.58,88.26 29.43,89.11 29.43,89.98 29.04,90.38 29.97,91.31 30.41,91.31
XOUT: length 2.5
  Bottom Layer w0.2: 30.03,88.56 29.45,88.56 28.75,87.86 27.8,87.86

## Copper pours and planes (outline as drawn; the poured copper is in the pictures)
+1V1 on Bottom Layer: 22.61,85.66 22.61,86.21 22.76,86.21 22.76,89.26 25.96,89.26 25.96,86.66 26.76,86.66 26.76,87.36 26.61,87.36 26.61,89.91 22.16,89.91 22.16,87.11 21.91,87.11 21.91,86.66 21.56,86.66 21.56,85.66
+1V2 on Bottom Layer: 25.31,76.96 25.31,76.41 25.16,76.41 25.16,73.36 21.96,73.36 21.96,75.96 21.16,75.96 21.16,75.26 21.31,75.26 21.31,72.71 25.76,72.71 25.76,75.51 26.01,75.51 26.01,75.96 26.36,75.96 26.36,76.96
+3V3 on Bottom Layer: 20.76,77.76 20.76,72.16 26.36,72.16 26.36,77.76
+3V3 on Bottom Layer: 27.16,84.86 27.16,90.46 21.56,90.46 21.56,84.86
GND on Top Layer: 0,94.45 94.49,94.45 94.49,0 0,0
GND on Bottom Layer: 0,94.45 94.49,94.45 94.49,0 0,0

Small or netless copper shapes (teardrops, artwork), in the pictures only: 69 on Top Layer, 57 on Bottom Layer

## Text on the board
Bottom Silkscreen Layer: RESET | BOOT
